# Altium project RF-lxSpark_1v0.PrjPcb
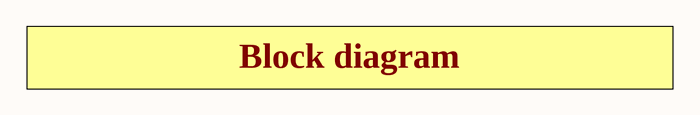
[diagram p0: 01_BlockDiagram.SchDoc]
7 sheets, 358 parts. Net scope: global (net labels, ports and power ports of the same name join across sheets).
Board file: SoDeRa-PCIe_1v0.PcbDoc
Sheets:
  01_BlockDiagram.SchDoc
  02_PowerDiagram.SchDoc
  03_ClockDiagram.SchDoc
  05_LMS7002M_RF.SchDoc
  06_LMS7002M_Power.SchDoc
  10_FPGA_power.SchDoc
  14_Clocks_2.SchDoc

## Sheet 01_BlockDiagram.SchDoc: Block diagram
size A4; Organization: Lime Microsystems; Address1: Surrey Tech Centre; Address2: Guildford GU2 7YG; Address3: Surrey; Address4: United Kingdom; Revision: SoDeRa-PCI v1.0; SheetNumber: 1; SheetTotal: 15

### Notes on the sheet
- Block diagram
- Title
- Size:
- Date:
- A4
- Revision:
- Time:
- Sheet
- of
- File:

## Sheet 02_PowerDiagram.SchDoc: Power diagram
size A4; Organization: Lime Microsystems; Address1: Surrey Tech Centre; Address2: Guildford GU2 7YG; Address3: Surrey; Address4: United Kingdom; Revision: SoDeRa-PCI v1.0; SheetNumber: 2; SheetTotal: 15
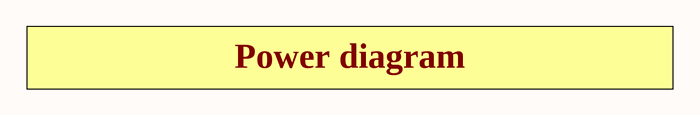
[diagram p1: 02_PowerDiagram.SchDoc]

### Notes on the sheet
- Power diagram
- Title
- Size:
- Date:
- A4
- Revision:
- Time:
- Sheet
- of
- File:

## Sheet 03_ClockDiagram.SchDoc: Clock diagram
size A4; Organization: Lime Microsystems; Address1: Surrey Tech Centre; Address2: Guildford GU2 7YG; Address3: Surrey; Address4: United Kingdom; Revision: SoDeRa-PCI v1.0; SheetNumber: 3; SheetTotal: 15
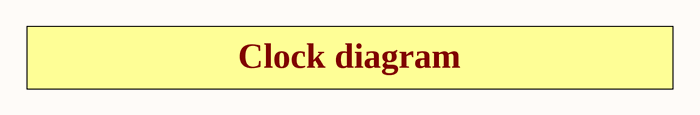
[diagram p2: 03_ClockDiagram.SchDoc]

### Notes on the sheet
- Clock diagram
- Title
- Size:
- Date:
- A4
- Revision:
- Time:
- Sheet
- of
- File:

## Sheet 05_LMS7002M_RF.SchDoc: LMS7002M 2 RF
size A3; Organization: Lime Microsystems; Address1: Surrey Tech Centre; Address2: Guildford GU2 7YG; Address3: Surrey; Address4: United Kingdom; Revision: SoDeRa-PCI v1.0; SheetNumber: 5; SheetTotal: 15
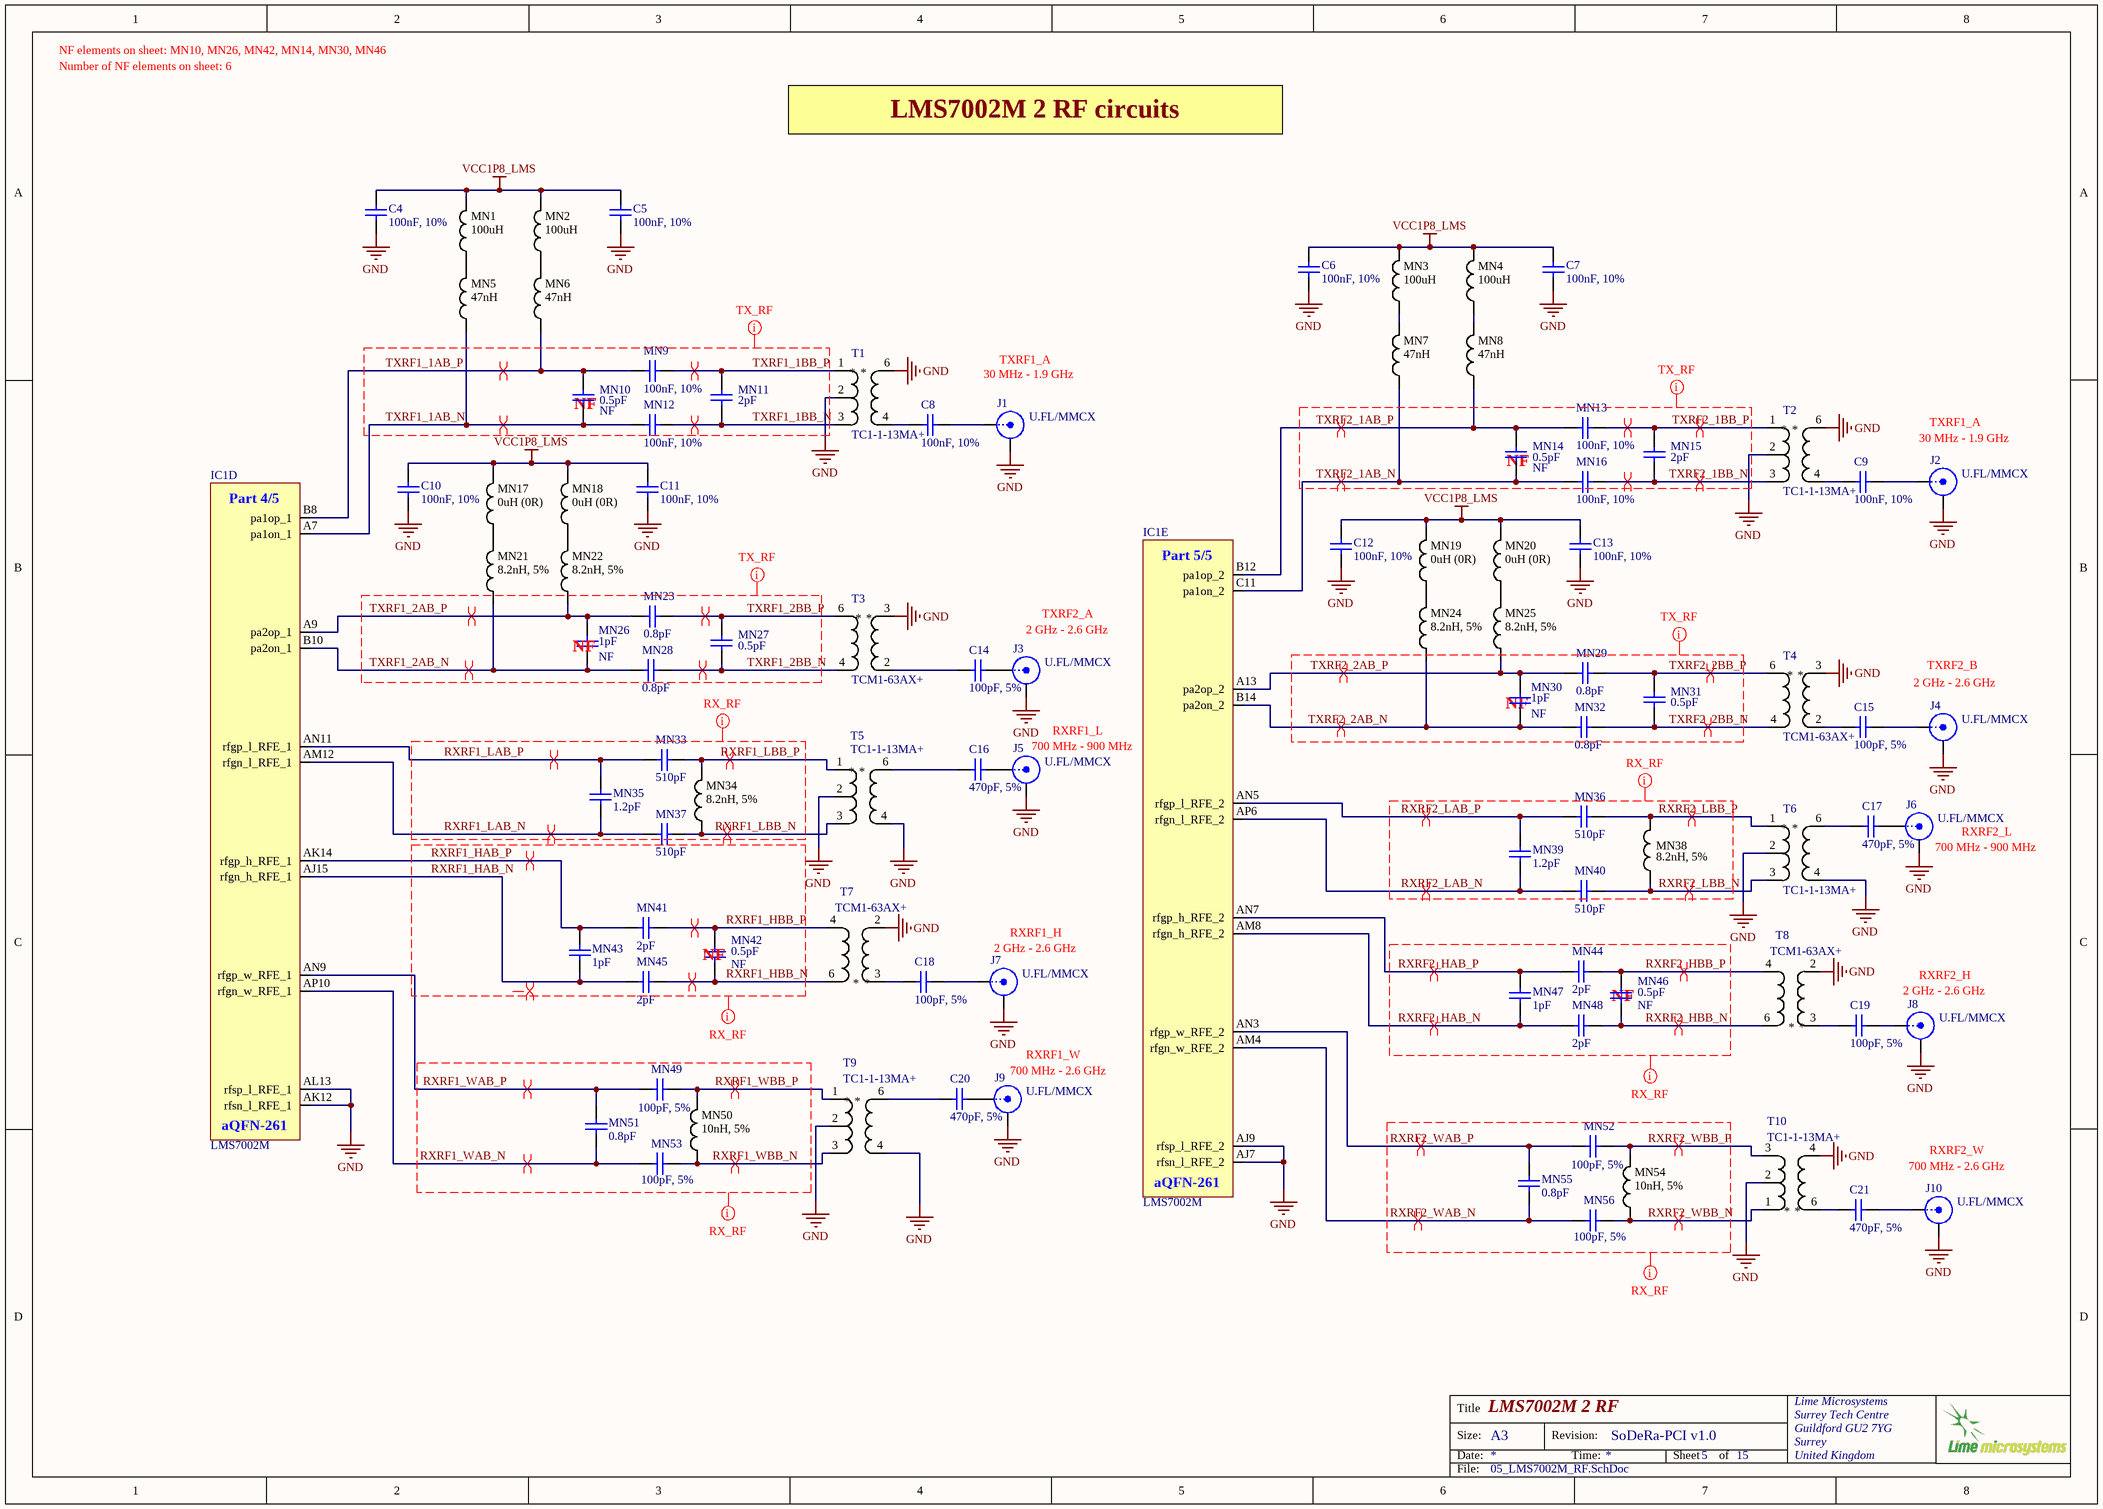
[diagram p3: 05_LMS7002M_RF.SchDoc]

### Parts
C4  100nF, 10%  [CAP0402]
C5  100nF, 10%  [CAP0402]
C6  100nF, 10%  [CAP0402]
C7  100nF, 10%  [CAP0402]
C8  100nF, 10%  [CAP0402]
C9  100nF, 10%  [CAP0402]
C10  100nF, 10%  [CAP0402]
C11  100nF, 10%  [CAP0402]
C12  100nF, 10%  [CAP0402]
C13  100nF, 10%  [CAP0402]
C14  100pF, 5%  [CAP0402]
C15  100pF, 5%  [CAP0402]
C16  470pF, 5%  [CAP0402]
C17  470pF, 5%  [CAP0402]
C18  100pF, 5%  [CAP0402]
C19  100pF, 5%  [CAP0402]
C20  470pF, 5%  [CAP0402]
C21  470pF, 5%  [CAP0402]
IC1  LMS7002M  [LMS7002M]  (parts D,E of 5)
J1  U.FL/MMCX  [MMCX_UFL_conn_u]
J2  U.FL/MMCX  [MMCX_UFL_conn_u]
J3  U.FL/MMCX  [MMCX_UFL_conn_u]
J4  U.FL/MMCX  [MMCX_UFL_conn_u]
J5  U.FL/MMCX  [MMCX_UFL_conn_u]
J6  U.FL/MMCX  [MMCX_UFL_conn_u]
J7  U.FL/MMCX  [MMCX_UFL_conn_u]
J8  U.FL/MMCX  [MMCX_UFL_conn_u]
J9  U.FL/MMCX  [MMCX_UFL_conn_u]
J10  U.FL/MMCX  [MMCX_UFL_conn_u]
MN1  100uH  [RES0805]
MN2  100uH  [RES0805]
MN3  100uH  [RES0805]
MN4  100uH  [RES0805]
MN5  47nH  [RES0402]
MN6  47nH  [RES0402]
MN7  47nH  [RES0402]
MN8  47nH  [RES0402]
MN9  100nF, 10%  [CAP0402]
MN10  0.5pF  Assembly Info: NF  [CAP0402]
MN11  2pF  [CAP0402]
MN12  100nF, 10%  [CAP0402]
MN13  100nF, 10%  [CAP0402]
MN14  0.5pF  Assembly Info: NF  [CAP0402]
MN15  2pF  [CAP0402]
MN16  100nF, 10%  [CAP0402]
MN17  0uH (0R)  [RES0805]
MN18  0uH (0R)  [RES0805]
MN19  0uH (0R)  [RES0805]
MN20  0uH (0R)  [RES0805]
MN21  8.2nH, 5%  [RES0402]
MN22  8.2nH, 5%  [RES0402]
MN23  0.8pF  [CAP0402]
MN24  8.2nH, 5%  [RES0402]
MN25  8.2nH, 5%  [RES0402]
MN26  1pF  Assembly Info: NF  [CAP0402]
MN27  0.5pF  [CAP0402]
MN28  0.8pF  [CAP0402]
MN29  0.8pF  [CAP0402]
MN30  1pF  Assembly Info: NF  [CAP0402]
MN31  0.5pF  [CAP0402]
MN32  0.8pF  [CAP0402]
MN33  510pF  [CAP0402]
MN34  8.2nH, 5%  [RES0402]
MN35  1.2pF  [CAP0402]
MN36  510pF  [CAP0402]
MN37  510pF  [CAP0402]
MN38  8.2nH, 5%  [RES0402]
MN39  1.2pF  [CAP0402]
MN40  510pF  [CAP0402]
MN41  2pF  [CAP0402]
MN42  0.5pF  Assembly Info: NF  [CAP0402]
MN43  1pF  [CAP0402]
MN44  2pF  [CAP0402]
MN45  2pF  [CAP0402]
MN46  0.5pF  Assembly Info: NF  [CAP0402]
MN47  1pF  [CAP0402]
MN48  2pF  [CAP0402]
MN49  100pF, 5%  [CAP0402]
MN50  10nH, 5%  [RES0402]
MN51  0.8pF  [CAP0402]
MN52  100pF, 5%  [CAP0402]
MN53  100pF, 5%  [CAP0402]
MN54  10nH, 5%  [RES0402]
MN55  0.8pF  [CAP0402]
MN56  100pF, 5%  [CAP0402]
T1  TC1-1-13MA+  [TC1-1-13MA+_v2]
T2  TC1-1-13MA+  [TC1-1-13MA+_v2]
T3  TCM1-63AX+  [TCM1-63AX+_v2]
T4  TCM1-63AX+  [TCM1-63AX+_v2]
T5  TC1-1-13MA+  [TC1-1-13MA+_v2]
T6  TC1-1-13MA+  [TC1-1-13MA+_v2]
T7  TCM1-63AX+  [TCM1-63AX+_v2]
T8  TCM1-63AX+  [TCM1-63AX+_v2]
T9  TC1-1-13MA+  [TC1-1-13MA+_v2]
T10  TC1-1-13MA+  [TC1-1-13MA+_v2]

### Nets
GND: C4.1 C5.1 C6.1 C7.1 C10.1 C11.1 C12.1 C13.1 IC1.AJ7(rfsn_l_RFE_2) IC1.AJ9(rfsp_l_RFE_2) IC1.AK12(rfsn_l_RFE_1) IC1.AL13(rfsp_l_RFE_1) J1.2(Y) J2.2(Y) J3.2(Y) J4.2(Y) J5.2(Y) J6.2(Y) J7.2(Y) J8.2(Y) J9.2(Y) J10.2(Y) T1.2 T1.6 T2.2 T2.6 T3.3 T4.3 T5.2 T5.4 T6.2 T6.4 T7.2 T8.2 T9.2 T9.4 T10.2 T10.4
VCC1P8_LMS: C4.2 C5.2 C6.2 C7.2 C10.2 C11.2 C12.2 C13.2 MN1.2 MN2.2 MN3.2 MN4.2 MN17.2 MN18.2 MN19.2 MN20.2
RXRF1_HAB_N: IC1.AJ15(rfgn_h_RFE_1) MN43.1 MN45.2
RXRF1_HAB_P: IC1.AK14(rfgp_h_RFE_1) MN41.2 MN43.2
RXRF1_HBB_N: MN42.1 MN45.1 T7.6
RXRF1_HBB_P: MN41.1 MN42.2 T7.4
RXRF1_LAB_N: IC1.AM12(rfgn_l_RFE_1) MN35.1 MN37.2
RXRF1_LAB_P: IC1.AN11(rfgp_l_RFE_1) MN33.2 MN35.2
RXRF1_LBB_N: MN34.1 MN37.1 T5.3
RXRF1_LBB_P: MN33.1 MN34.2 T5.1
RXRF1_WAB_N: IC1.AP10(rfgn_w_RFE_1) MN51.2 MN53.2
RXRF1_WAB_P: IC1.AN9(rfgp_w_RFE_1) MN49.2 MN51.1
RXRF1_WBB_N: MN50.1 MN53.1 T9.3
RXRF1_WBB_P: MN49.1 MN50.2 T9.1
RXRF2_HAB_N: IC1.AM8(rfgn_h_RFE_2) MN47.1 MN48.2
RXRF2_HAB_P: IC1.AN7(rfgp_h_RFE_2) MN44.2 MN47.2
RXRF2_HBB_N: MN46.1 MN48.1 T8.6
RXRF2_HBB_P: MN44.1 MN46.2 T8.4
RXRF2_LAB_N: IC1.AP6(rfgn_l_RFE_2) MN39.1 MN40.2
RXRF2_LAB_P: IC1.AN5(rfgp_l_RFE_2) MN36.2 MN39.2
RXRF2_LBB_N: MN38.1 MN40.1 T6.3
RXRF2_LBB_P: MN36.1 MN38.2 T6.1
RXRF2_WAB_N: IC1.AM4(rfgn_w_RFE_2) MN55.2 MN56.2
RXRF2_WAB_P: IC1.AN3(rfgp_w_RFE_2) MN52.2 MN55.1
RXRF2_WBB_N: MN54.1 MN56.1 T10.1
RXRF2_WBB_P: MN52.1 MN54.2 T10.3
TXRF1_1AB_N: IC1.A7(pa1on_1) MN5.1 MN10.1 MN12.1
TXRF1_1AB_P: IC1.B8(pa1op_1) MN6.1 MN9.2 MN10.2
TXRF1_1BB_N: MN11.1 MN12.2 T1.3
TXRF1_1BB_P: MN9.1 MN11.2 T1.1
TXRF1_2AB_N: IC1.B10(pa2on_1) MN21.1 MN26.2 MN28.2
TXRF1_2AB_P: IC1.A9(pa2op_1) MN22.1 MN23.2 MN26.1
TXRF1_2BB_N: MN27.1 MN28.1 T3.4
TXRF1_2BB_P: MN23.1 MN27.2 T3.6
TXRF2_1AB_N: IC1.C11(pa1on_2) MN7.1 MN14.1 MN16.1
TXRF2_1AB_P: IC1.B12(pa1op_2) MN8.1 MN13.2 MN14.2
TXRF2_1BB_N: MN15.1 MN16.2 T2.3
TXRF2_1BB_P: MN13.1 MN15.2 T2.1
TXRF2_2AB_N: IC1.B14(pa2on_2) MN24.1 MN30.2 MN32.2
TXRF2_2AB_P: IC1.A13(pa2op_2) MN25.1 MN29.2 MN30.1
TXRF2_2BB_N: MN31.1 MN32.1 T4.4
TXRF2_2BB_P: MN29.1 MN31.2 T4.6
NetC8_1: C8.1 J1.1(X)
NetC8_2: C8.2 T1.4
NetC9_1: C9.1 J2.1(X)
NetC9_2: C9.2 T2.4
NetC14_1: C14.1 J3.1(X)
NetC14_2: C14.2 T3.2
NetC15_1: C15.1 J4.1(X)
NetC15_2: C15.2 T4.2
NetC16_1: C16.1 J5.1(X)
NetC16_2: C16.2 T5.6
NetC17_1: C17.1 J6.1(X)
NetC17_2: C17.2 T6.6
NetC18_1: C18.1 J7.1(X)
NetC18_2: C18.2 T7.3
NetC19_1: C19.1 J8.1(X)
NetC19_2: C19.2 T8.3
NetC20_1: C20.1 J9.1(X)
NetC20_2: C20.2 T9.6
NetC21_1: C21.1 J10.1(X)
NetC21_2: C21.2 T10.6
NetMN1_1: MN1.1 MN5.2
NetMN2_1: MN2.1 MN6.2
NetMN3_1: MN3.1 MN7.2
NetMN4_1: MN4.1 MN8.2
NetMN17_1: MN17.1 MN21.2
NetMN18_1: MN18.1 MN22.2
NetMN19_1: MN19.1 MN24.2
NetMN20_1: MN20.1 MN25.2

### Layout directives
differential pair: RXRF1_HAB_N, RXRF1_HAB_P, RXRF1_HBB_N, RXRF1_HBB_P, RXRF1_LAB_N, RXRF1_LAB_P, RXRF1_LBB_N, RXRF1_LBB_P, RXRF1_WAB_N, RXRF1_WAB_P, RXRF1_WBB_N, RXRF1_WBB_P, RXRF2_HAB_N, RXRF2_HAB_P, RXRF2_HBB_N, RXRF2_HBB_P, RXRF2_LAB_N, RXRF2_LAB_P, RXRF2_LBB_N, RXRF2_LBB_P, RXRF2_WAB_N, RXRF2_WAB_P, RXRF2_WBB_N, RXRF2_WBB_P, TXRF1_1AB_N, TXRF1_1AB_P, TXRF1_1BB_N, TXRF1_1BB_P, TXRF1_2AB_N, TXRF1_2AB_P, TXRF1_2BB_N, TXRF1_2BB_P, TXRF2_1AB_N, TXRF2_1AB_P, TXRF2_1BB_N, TXRF2_1BB_P, TXRF2_2AB_N, TXRF2_2AB_P, TXRF2_2BB_N, TXRF2_2BB_P
net class TX_RF: TXRF1_1AB_N, TXRF1_1AB_P, TXRF1_1BB_N, TXRF1_1BB_P, TXRF1_2AB_N, TXRF1_2AB_P, TXRF1_2BB_N, TXRF1_2BB_P, TXRF2_1AB_N, TXRF2_1AB_P, TXRF2_1BB_N, TXRF2_1BB_P, TXRF2_2AB_N, TXRF2_2AB_P, TXRF2_2BB_N, TXRF2_2BB_P
net class RX_RF: RXRF1_HAB_N, RXRF1_HAB_P, RXRF1_HBB_N, RXRF1_HBB_P, RXRF1_LAB_N, RXRF1_LAB_P, RXRF1_LBB_N, RXRF1_LBB_P, RXRF1_WAB_N, RXRF1_WAB_P, RXRF1_WBB_N, RXRF1_WBB_P, RXRF2_HAB_N, RXRF2_HAB_P, RXRF2_HBB_N, RXRF2_HBB_P, RXRF2_LAB_N, RXRF2_LAB_P, RXRF2_LBB_N, RXRF2_LBB_P, RXRF2_WAB_N, RXRF2_WAB_P, RXRF2_WBB_N, RXRF2_WBB_P

### Notes on the sheet
- Number of NF elements on sheet: 6
- NF elements on sheet: MN10, MN26, MN42, MN14, MN30, MN46
- LMS7002M 2 RF circuits
- 30 MHz - 1.9 GHz
- TXRF1_A
- (near MN10) NF
- (near J2) 30 MHz - 1.9 GHz
- (near MN14) NF
- (near MN26) NF
- 2 GHz - 2.6 GHz
- TXRF2_A
- (near MN30) NF
- TXRF2_B
- (near J5) 700 MHz - 900 MHz
- RXRF1_L
- (near J6) 700 MHz - 900 MHz
- (near J6) RXRF2_L
- (near MN42) NF
- (near J7) 2 GHz - 2.6 GHz
- (near J7) RXRF1_H
- RXRF2_H
- RXRF1_W
- (near MN46) NF
- (near J8) 2 GHz - 2.6 GHz
- (near J9) 700 MHz - 2.6 GHz
- 700 MHz - 2.6 GHz
- (near J10) RXRF2_W
- Title
- Size:
- Date:
- A3
- Revision:
- Time:
- Sheet
- of
- File:
- (in symbol LMS7002M, part D) Part 4/5; aQFN-261
- (in symbol LMS7002M, part E) Part 5/5; aQFN-261

### Library data of the parts
C4-C13 = Cap_0402: Manufacturer: Murata Electronics; Manufacturer Part Number: GRM155R71C104KA88D; Voltage Rating DC: 16 V; Type: General Purpose MLCC; Capacitance: 0.1 uF; Case Length: 1 mm; Dielectric: X7R; Case Height: 0.5 mm; Temperature Coefficient / Code: +/- 15 %; Value: 100nF, 10%; Supplier 1: Mouser; Supplier Part Number 1: 81-GRM155R71C104KA88; Case Code - in: 0402; RoHS: RoHS Compliant; Operating Temperature Range: - 55 C to + 125 C; Series: GRM; Termination Style: SMD/SMT; Tolerance: 10 %; Package / Case: 0402 (1005 metric); Maximum Operating Temperature: + 125 C; Case Code - mm: 1005; Minimum Operating Temperature: - 55 C; Product Category: Low & Medium Capacitance SMD Ceramic Chip Capacitors; Packaging: Reel; Product: General Type MLCCs; Category: Multilayer Ceramic Capacitors MLCC - SMD/SMT; Brand: Murata Electronics; Case Width: 0.5 mm; RoHS - Mouser: Y; Standard Pack Qty: 10000; Minimum Order Quantity: 1; Reeling: True; Manufacturer Part Number 1: GRM155R71C104KA88D
C14 C15 C18 C19 MN49 MN52 MN53 MN56 = Cap_0402: Manufacturer Part Number 1: CC0402JRNPO9BN101; Manufacturer: Yageo; Temperature Coefficient: C0G, NP0; Voltage - Rated: 50V; Value: 100pF, 5%; Capacitance: 100pF; Thickness (Max): 0.022" (0.55mm); Size / Dimension: 0.039" L x 0.020" W (1.00mm x 0.50mm); Tolerance: ±5%; RoHS: RoHS Compliant; Ratings: -; Package / Case: 0402 (1005 Metric); Mounting Type: Surface Mount, MLCC; Height - Seated (Max): -; Features: -; Lead Spacing: -; Operating Temperature: -55°C ~ 125°C; Packaging: Cut Tape (CT); Applications: General Purpose; Lead Style: -; Supplier 1: Digi-Key; Category: Capacitors; Supplier Part Number 1: 311-1024-1-ND
C16 C17 C20 C21 = Cap_0402: Manufacturer Part Number: C1005C0G1H471J050BA; Manufacturer: TDK Corporation; Temperature Coefficient: C0G, NP0; Voltage - Rated: 50V; Value: 470pF, 5%; Supplier 1: Digi-Key; Supplier Part Number 1: 445-2656-6-ND; Ratings: -; Package / Case: 0402 (1005 Metric); Capacitance: 470pF; Packaging: Digi-Reel®; RoHS: RoHS Compliant; Tolerance: ±5%; Lead Style: -; Thickness (Max): 0.022" (0.55mm); Size / Dimension: 0.039" L x 0.020" W (1.00mm x 0.50mm); Lead Spacing: -; Operating Temperature: -55°C ~ 125°C; Height - Seated (Max): -; Applications: General Purpose; Mounting Type: Surface Mount, MLCC; Category: Capacitors; Features: -
J1-J10 = RF_IF_connector: CONN UMC RCPT STR 50 OHM SMD; Manufacturer: Molex, LLC; Manufacturer Part Number 1: 0734120110; Body Finish: Nickel; Body Material: Phosphor Bronze; Center Contact Material: Brass; Center Contact Plating: Gold; Connector Style: Ultra Miniature Coaxial; Connector Type: Jack, Male Pin; Contact Termination: Solder; Dielectric Material: Liquid Crystal Polymer (LCP); Frequency - Max: 6GHz; Impedance: 50 Ohm; Voltage Rating: 60V; Cable Group: -; Category: Connectors, Interconnects; Fastening Type: Snap-On; Features: -; Housing Color: Silver; Ingress Protection: -; Mounting Type: Surface Mount; Operating Temperature: -40°C ~ 90°C; Packaging: Cut Tape (CT); RoHS: RoHS Compliant; Shield Termination: Solder; Supplier 1: Digi-Key; Supplier Part Number 1: WM5587CT-ND
MN1-MN4 = Inductor_0603: Manufacturer: TDK Corporation; Manufacturer Part Number: MLF2012C101KT000; Q @ Freq: 25 @ 1MHz; Shielding: Shielded; Current Rating: 2mA; Frequency - Self Resonant: 7MHz; Frequency - Test: 1MHz; Material - Core: Ferrite; Tolerance: ±10%; Inductance: 100µH; DC Resistance (DCR): 3.1 Ohm Max; Value: 100uH; Supplier 1: Digi-Key; Supplier Part Number 1: 445-1071-1-ND; Supplier Device Package: 0805 (2012 Metric); Size / Dimension: 0.079" L x 0.049" W (2.00mm x 1.25mm); Operating Temperature: -40°C ~ 85°C; Packaging: Cut Tape (CT); RoHS: RoHS Compliant; Current - Saturation: -; Height - Seated (Max): 0.057" (1.45mm); Package / Case: 0805 (2012 Metric); Mounting Type: Surface Mount; Type: Multilayer; Category: Inductors, Coils, Chokes
MN5-MN8 = Inductor_0603: Manufacturer: COILCRAFT; Manufacturer Part Number: 0402HP-47NXJLU; SVHC: No SVHC (15-Jun-2015); Inductance Tolerance: ± 5%; High Frequency Inductor Case: 0402 [1005 Metric]; Inductor Case Style: 0402 [1005 Metric]<!--FANDB--><div class="features-and-benefits-container"></div>; Inductance: 47; DC Resistance Max: 0.58; Self Resonant Frequency Min: 2.4; Product Range: 0402; DC Current Rating: 420; Inductor Construction: Wirewound; Supplier 1: Farnell; Supplier Part Number 1: 2285856; Packaging: Cut Tape; RoHS: Y-EX; value: 47nH
MN9 MN12 MN13 MN16 = Cap_0402: Manufacturer: Murata Electronics; Manufacturer Part Number: GRM155R71C104KA88D; Voltage Rating DC: 16 V; Capacitance: 0.1 uF; Case Length: 1 mm; Dielectric: X7R; Case Height: 0.5 mm; Temperature Coefficient / Code: +/- 15 %; Value: 100nF, 10%; Supplier 1: Mouser; Supplier Part Number 1: 81-GRM155R71C104KA88; Case Code - in: 0402; RoHS: RoHS Compliant; Operating Temperature Range: - 55 C to + 125 C; Series: GRM; Termination Style: SMD/SMT; Tolerance: 10 %; Package / Case: 0402 (1005 metric); Type: General Purpose MLCC; Maximum Operating Temperature: + 125 C; Case Code - mm: 1005; Minimum Operating Temperature: - 55 C; Product Category: Low & Medium Capacitance SMD Ceramic Chip Capacitors; Packaging: Reel; Product: General Type MLCCs; Category: Multilayer Ceramic Capacitors MLCC - SMD/SMT; Brand: Murata Electronics; Case Width: 0.5 mm; RoHS - Mouser: Y; Standard Pack Qty: 10000; Minimum Order Quantity: 1; Reeling: True; Manufacturer Part Number 1: GRM155R71C104KA88D
MN10 MN14 MN27 MN31 MN42 MN46 = Cap_0402: Manufacturer: Yageo; Manufacturer Part Number 1: CC0402CRNPO9BNR50; Capacitance: 0.50pF; Voltage - Rated: 50V; Temperature Coefficient: C0G, NP0; Tolerance: ±0.25pF; Value: 0.5pF; Supplier 1: Digi-Key; Supplier Part Number 1: 311-1001-1-ND; RoHS: RoHS Compliant; Thickness (Max): 0.022" (0.55mm); Features: -; Height - Seated (Max): -; Lead Spacing: -; Applications: General Purpose; Packaging: Cut Tape (CT); Ratings: -; Size / Dimension: 0.039" L x 0.020" W (1.00mm x 0.50mm); Lead Style: -; Mounting Type: Surface Mount, MLCC; Operating Temperature: -55°C ~ 125°C; Package / Case: 0402 (1005 Metric); Category: Capacitors
MN11 MN15 MN41 MN44 MN45 MN48 = Cap_0402: Manufacturer Part Number: 04025U2R0BAT2A; Manufacturer: AVX; Product Range: U Series; Voltage Rating: 50; SVHC: No SVHC (17-Dec-2014); Capacitance Tolerance: ± 0.1; Ceramic Capacitor Case: 0402 [1005 Metric]; Capacitance: 2; Dielectric Characteristic: C0G / NP0; Value: 2pF; Supplier 1: Farnell; Supplier Part Number 1: 2332536; Operating Temperature Max: 125; RoHS: YES; Operating Temperature Min: -55; Capacitance Tolerance ±: ± 0.1; Packaging: Cut Tape; MSL: MSL 1 - Unlimited
MN17-MN20 = Inductor_0603: Manufacturer: BOURNS; Manufacturer Part Number: CR0805-J/-000ELF; Value: 0uH (0R); Supplier 1: Farnell; Supplier Part Number 1: 2008388; RoHS: YES
MN21 MN22 MN24 MN25 MN34 MN38 = Inductor_0603: Manufacturer: COILCRAFT; Manufacturer Part Number 1: 0402HP-8N2XJLU; Inductor Construction: Wirewound; DC Current Rating: 1.5; Inductor Case Style: 0402 [1005 Metric]<!--FANDB--><div class="features-and-benefits-container"></div>; Self Resonant Frequency Min: 5.4; DC Resistance Max: 0.065; High Frequency Inductor Case: 0402 [1005 Metric]; SVHC: No SVHC (16-Jun-2014); Inductance: 8.2; Supplier 1: Farnell; Supplier Part Number 1: 2285826; Packaging: Cut Tape; Product Range: COILCRAFT - 0402; Inductance Tolerance: ± 5%; RoHS: Y-EX; Value: 8.2nH, 5%
MN23 MN28 MN29 MN32 MN51 MN55 = Cap_0402: Manufacturer: Murata Electronics North America; Manufacturer Part Number: GRM1555C1HR80BA01D; Temperature Coefficient: C0G, NP0; Capacitance: 0.80pF; Voltage - Rated: 50V; Tolerance: ±0.1pF; Value: 0.8pF; Applications: General Purpose; Operating Temperature: -55°C ~ 125°C; Size / Dimension: 0.039" L x 0.020" W (1.00mm x 0.50mm); Features: -; Supplier 1: Digi-Key; Height - Seated (Max): -; Category: Capacitors; Package / Case: 0402 (1005 Metric); Mounting Type: Surface Mount, MLCC; Lead Spacing: -; Thickness (Max): 0.022" (0.55mm); RoHS: RoHS Compliant; Supplier Part Number 1: 490-6269-1-ND; Packaging: Cut Tape (CT); Ratings: -; Lead Style: -
MN26 MN30 MN43 MN47 = Cap_0402: Manufacturer: TDK Corporation; Manufacturer Part Number 1: C1005C0G1H010B050BA; Voltage - Rated: 50V; Temperature Coefficient: C0G, NP0; Tolerance: ±0.1pF; Value: 1pF; Supplier 1: Digi-Key; Supplier Part Number 1: 445-4854-6-ND; Size / Dimension: 0.039" L x 0.020" W (1.00mm x 0.50mm); Lead Spacing: -; Operating Temperature: -55°C ~ 125°C; Thickness (Max): 0.022" (0.55mm); Package / Case: 0402 (1005 Metric); Features: -; Lead Style: -; Applications: General Purpose; Height - Seated (Max): -; Capacitance: 1pF; RoHS: RoHS Compliant; Mounting Type: Surface Mount, MLCC; Packaging: Digi-Reel®; Ratings: -; Category: Capacitors
MN33 MN36 MN37 MN40 = Cap_0402: Manufacturer: Murata Electronics North America; Manufacturer Part Number: GRM1555C1H511JA01D; Voltage - Rated: 50V; Temperature Coefficient: C0G, NP0; Tolerance: ±5%; Value: 510pF; Supplier 1: Digi-Key; Supplier Part Number 1: 490-3237-1-ND; Height - Seated (Max): -; Features: -; Size / Dimension: 0.039" L x 0.020" W (1.00mm x 0.50mm); Applications: General Purpose; Lead Spacing: -; Package / Case: 0402 (1005 Metric); Ratings: -; Thickness (Max): 0.022" (0.55mm); Lead Style: -; Operating Temperature: -55°C ~ 125°C; Mounting Type: Surface Mount, MLCC; Capacitance: 510pF; Category: Capacitors; RoHS: RoHS Compliant; Packaging: Cut Tape (CT)
MN35 MN39 = Cap_0402: Manufacturer: Murata Electronics North America; Manufacturer Part Number: GRM1555C1H1R2CA01D; Temperature Coefficient: C0G, NP0; Voltage - Rated: 50V; Tolerance: ±0.25pF; Value: 1.2pF; Supplier 1: Digi-Key; Supplier Part Number 1: 490-5927-1-ND; Lead Style: -; Category: Capacitors; Features: -; Packaging: Cut Tape (CT); Operating Temperature: -55°C ~ 125°C; Package / Case: 0402 (1005 Metric); Applications: General Purpose; Size / Dimension: 0.039" L x 0.020" W (1.00mm x 0.50mm); Lead Spacing: -; Ratings: -; Mounting Type: Surface Mount, MLCC; RoHS: RoHS Compliant; Height - Seated (Max): -; Thickness (Max): 0.022" (0.55mm); Capacitance: 1.2pF
MN50 MN54 = Inductor_0603: Manufacturer Part Number: 0402HP-10NXJLU; Manufacturer: COILCRAFT; Value: 10nH, 5%; Supplier 1: Farnell; Supplier Part Number 1: 2285830; RoHS: Y-EX
T1 T2 T5 T6 T9 T10 = Balun: Manufacturer: Mini-Circuits; Manufacturer Part Number 1: TC1-1-13MA+; Supplier Part Number 1: TC1-1-13MA+
T3 T4 T7 T8 = Balun_v2: Manufacturer: Mini-circuits; Supplier Part Number 1: TCM1-63AX+; Manufacturer Part Number 1: TCM1-63AX+
IC1 = LMS7002M: Manufacturer Part Number 1: LMS7002M; Supplier 1: Lime Microsystems

## Sheet 06_LMS7002M_Power.SchDoc: LMS7002M 1 power supply
size A3 portrait; Organization: Lime Microsystems; Address1: Surrey Tech Centre; Address2: Guildford GU2 7YG; Address3: Surrey; Address4: United Kingdom; Revision: SoDeRa-PCI v1.0; SheetNumber: 6; SheetTotal: 15; PageSetup: Record=PageOptions|CenterHorizontal=True|CenterVertical=True|PrintScale=0.70|XCorrection=1.00|YCorrection=1.00|PrintKind=1|BorderSize=5000000|LeftOffset=0|BottomOffset=0|Orientation=1|PaperLength=2970|PaperWidth=2100|Scale=100|PaperSource=7|PrintQuality=600|MediaType=1|DitherType=10|PrintScaleMode=1|PaperKind=A4|PaperIndex=9
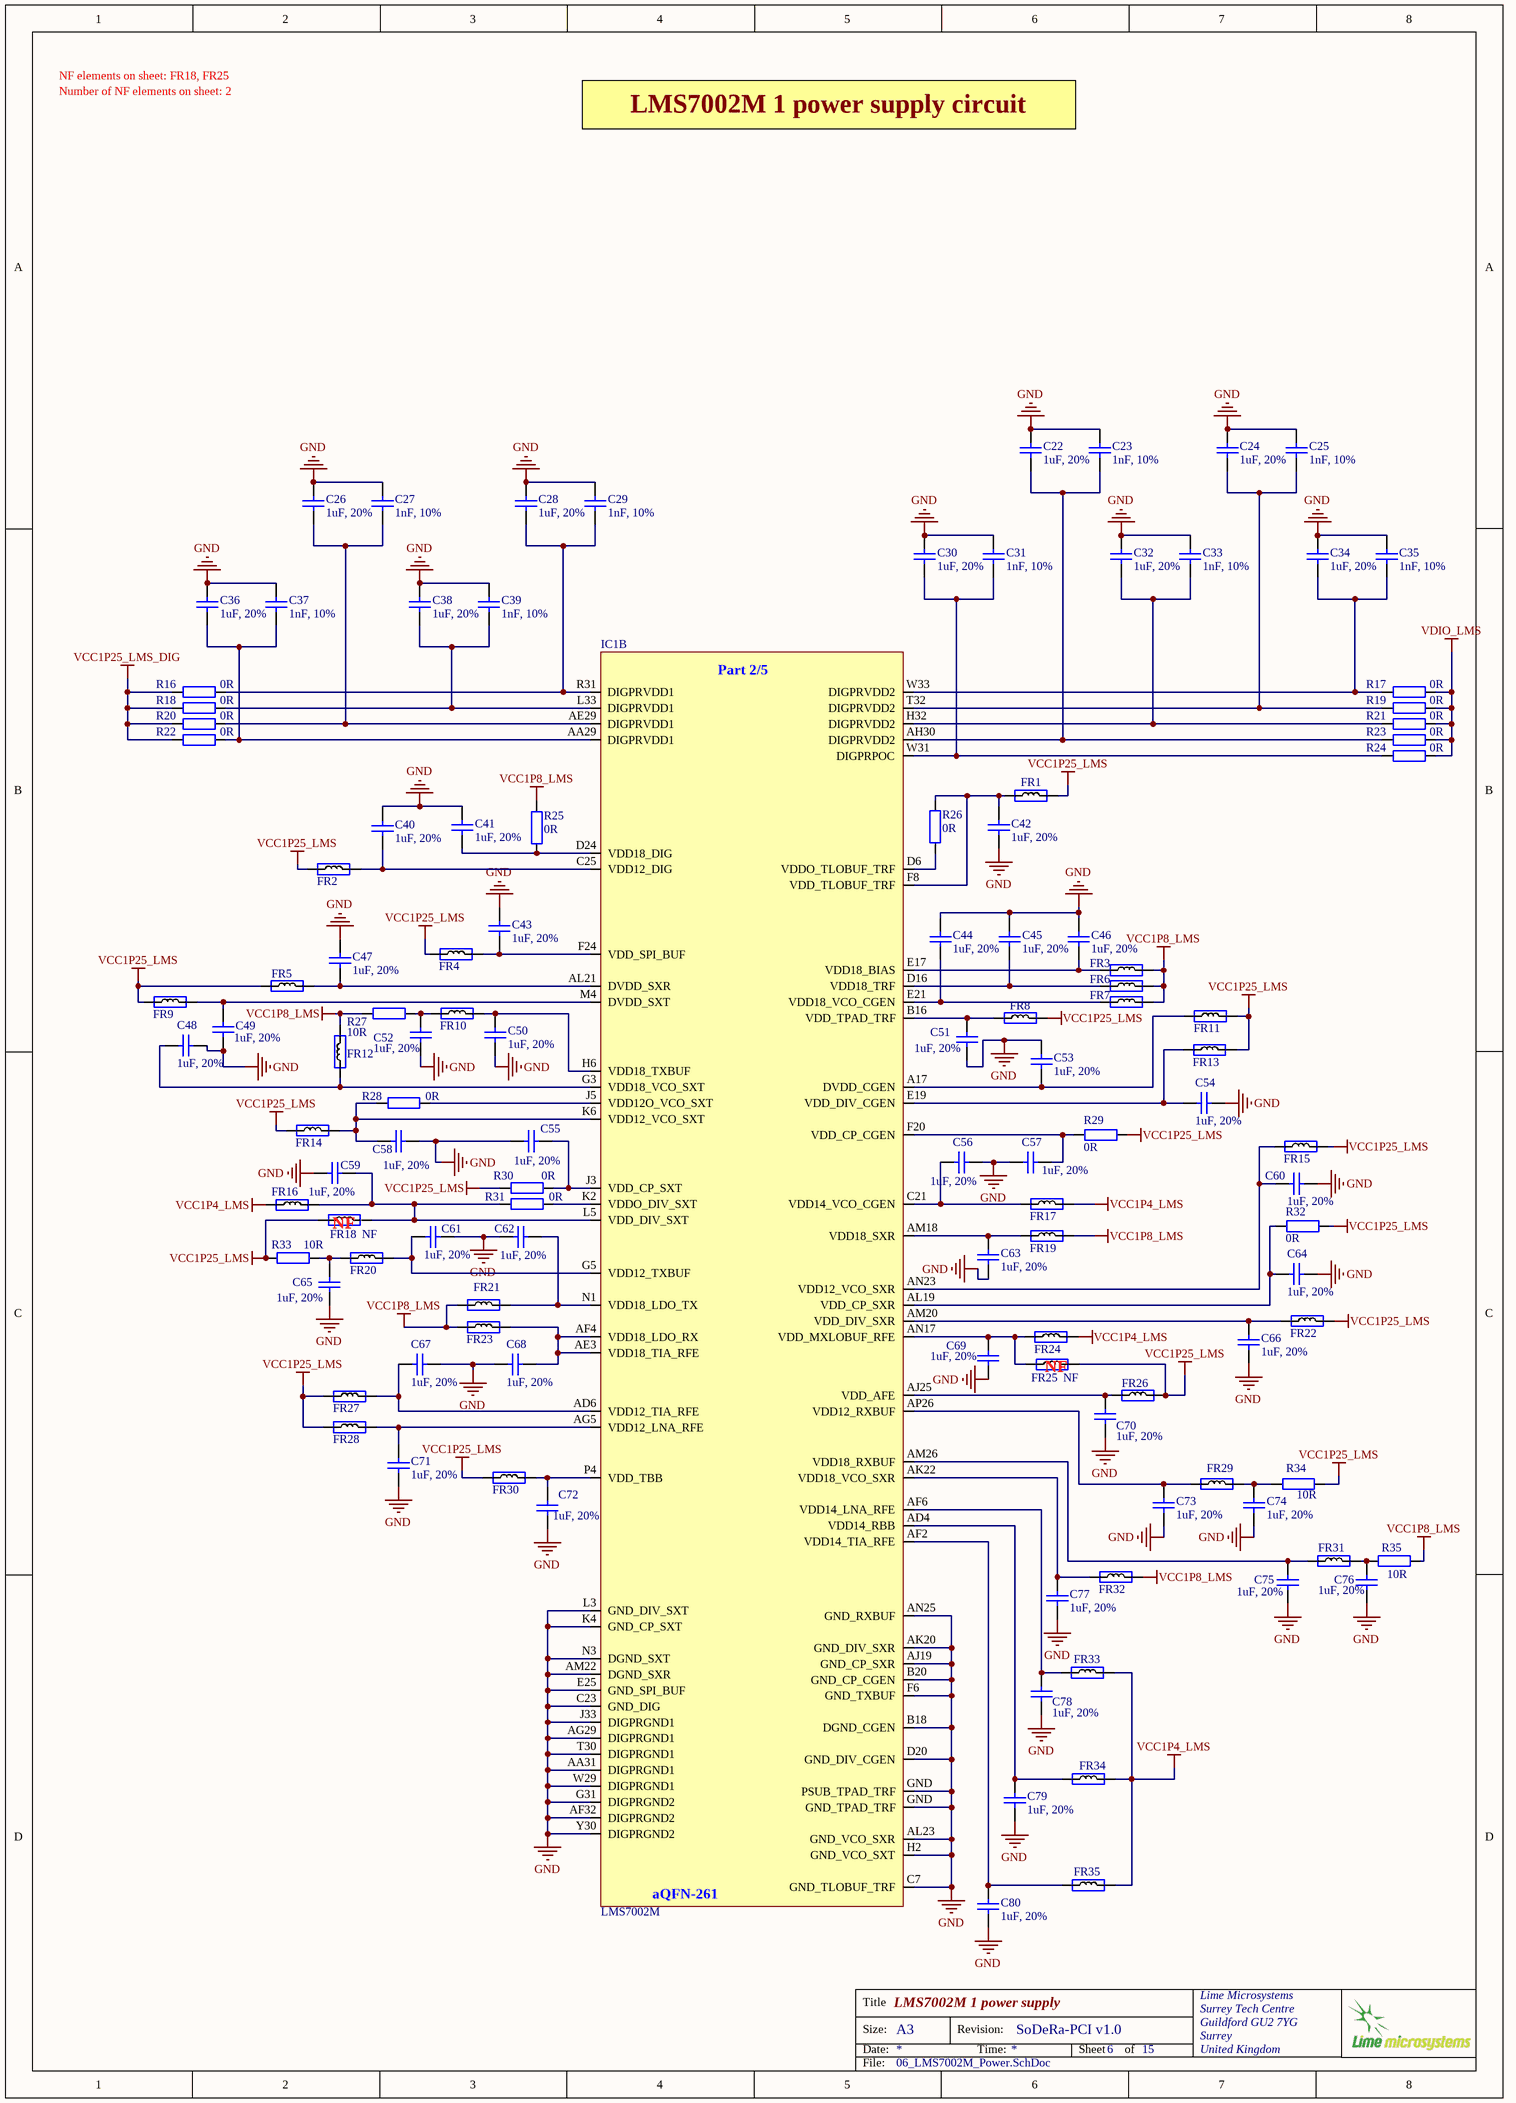
[diagram p4: 06_LMS7002M_Power.SchDoc]

### Parts
C22  1uF, 20%  [CAP0201]
C23  1nF, 10%  [CAP0201]
C24  1uF, 20%  [CAP0201]
C25  1nF, 10%  [CAP0201]
C26  1uF, 20%  [CAP0201]
C27  1nF, 10%  [CAP0201]
C28  1uF, 20%  [CAP0201]
C29  1nF, 10%  [CAP0201]
C30  1uF, 20%  [CAP0201]
C31  1nF, 10%  [CAP0201]
C32  1uF, 20%  [CAP0201]
C33  1nF, 10%  [CAP0201]
C34  1uF, 20%  [CAP0201]
C35  1nF, 10%  [CAP0201]
C36  1uF, 20%  [CAP0201]
C37  1nF, 10%  [CAP0201]
C38  1uF, 20%  [CAP0201]
C39  1nF, 10%  [CAP0201]
C40  1uF, 20%  [CAP0201]
C41  1uF, 20%  [CAP0201]
C42  1uF, 20%  [CAP0201]
C43  1uF, 20%  [CAP0201]
C44  1uF, 20%  [CAP0201]
C45  1uF, 20%  [CAP0201]
C46  1uF, 20%  [CAP0201]
C47  1uF, 20%  [CAP0201]
C48  1uF, 20%  [CAP0201]
C49  1uF, 20%  [CAP0201]
C50  1uF, 20%  [CAP0201]
C51  1uF, 20%  [CAP0201]
C52  1uF, 20%  [CAP0201]
C53  1uF, 20%  [CAP0201]
C54  1uF, 20%  [CAP0201]
C55  1uF, 20%  [CAP0201]
C56  1uF, 20%  [CAP0201]
C57  1uF, 20%  [CAP0201]
C58  1uF, 20%  [CAP0201]
C59  1uF, 20%  [CAP0201]
C60  1uF, 20%  [CAP0201]
C61  1uF, 20%  [CAP0201]
C62  1uF, 20%  [CAP0201]
C63  1uF, 20%  [CAP0201]
C64  1uF, 20%  [CAP0201]
C65  1uF, 20%  [CAP0201]
C66  1uF, 20%  [CAP0201]
C67  1uF, 20%  [CAP0201]
C68  1uF, 20%  [CAP0201]
C69  1uF, 20%  [CAP0201]
C70  1uF, 20%  [CAP0201]
C71  1uF, 20%  [CAP0201]
C72  1uF, 20%  [CAP0201]
C73  1uF, 20%  [CAP0201]
C74  1uF, 20%  [CAP0201]
C75  1uF, 20%  [CAP0201]
C76  1uF, 20%  [CAP0201]
C77  1uF, 20%  [CAP0201]
C78  1uF, 20%  [CAP0201]
C79  1uF, 20%  [CAP0201]
C80  1uF, 20%  [CAP0201]
FR1  Ferrite  [RES0201]  (value not drawn)
FR2  Ferrite  [RES0201]  (value not drawn)
FR3  Ferrite  [RES0201]  (value not drawn)
FR4  Ferrite  [RES0201]  (value not drawn)
FR5  Ferrite  [RES0201]  (value not drawn)
FR6  Ferrite  [RES0201]  (value not drawn)
FR7  Ferrite  [RES0201]  (value not drawn)
FR8  Ferrite  [RES0201]  (value not drawn)
FR9  Ferrite  [RES0201]  (value not drawn)
FR10  Ferrite  [RES0201]  (value not drawn)
FR11  Ferrite  [RES0201]  (value not drawn)
FR12  Ferrite  [RES0201]  (value not drawn)
FR13  Ferrite  [RES0201]  (value not drawn)
FR14  Ferrite  [RES0201]  (value not drawn)
FR15  Ferrite  [RES0201]  (value not drawn)
FR16  Ferrite  [RES0201]  (value not drawn)
FR17  Ferrite  [RES0201]  (value not drawn)
FR18  Assembly Info: NF  [RES0201]  (hidden comment: Ferrite)
FR19  Ferrite  [RES0201]  (value not drawn)
FR20  Ferrite  [RES0201]  (value not drawn)
FR21  Ferrite  [RES0201]  (value not drawn)
FR22  Ferrite  [RES0201]  (value not drawn)
FR23  Ferrite  [RES0201]  (value not drawn)
FR24  Ferrite  [RES0201]  (value not drawn)
FR25  Assembly Info: NF  [RES0201]  (hidden comment: Ferrite)
FR26  Ferrite  [RES0201]  (value not drawn)
FR27  Ferrite  [RES0201]  (value not drawn)
FR28  Ferrite  [RES0201]  (value not drawn)
FR29  Ferrite  [RES0201]  (value not drawn)
FR30  Ferrite  [RES0201]  (value not drawn)
FR31  Ferrite  [RES0201]  (value not drawn)
FR32  Ferrite  [RES0201]  (value not drawn)
FR33  Ferrite  [RES0201]  (value not drawn)
FR34  Ferrite  [RES0201]  (value not drawn)
FR35  Ferrite  [RES0201]  (value not drawn)
IC1  LMS7002M  [LMS7002M]  (part B of 5)
R16  0R  [RES0402]
R17  0R  [RES0402]
R18  0R  [RES0402]
R19  0R  [RES0402]
R20  0R  [RES0402]
R21  0R  [RES0402]
R22  0R  [RES0402]
R23  0R  [RES0402]
R24  0R  [RES0402]
R25  0R  [RES0201]
R26  0R  [RES0201]
R27  10R  [RES0201]
R28  0R  [RES0201]
R29  0R  [RES0201]
R30  0R  [RES0201]
R31  0R  [RES0201]
R32  0R  [RES0201]
R33  10R  [RES0201]
R34  10R  [RES0201]
R35  10R  [RES0201]

### Nets
GND: C22.2 C23.2 C24.2 C25.2 C26.2 C27.2 C28.2 C29.2 C30.2 C31.2 C32.2 C33.2 C34.2 C35.2 C36.2 C37.2 C38.2 C39.2 C40.2 C41.2 C42.2 C43.2 C44.2 C45.2 C46.2 C47.2 C48.2 C49.2 C50.2 C51.2 C52.2 C53.2 C54.2 C55.2 C56.2 C57.2 C58.1 C59.2 C60.2 C61.2 C62.2 C63.2 C64.2 C65.2 C66.2 C67.2 C68.2 C69.2 C70.2 C71.2 C72.2 C73.2 C74.2 C75.2 C76.2 C77.2 C78.2 C79.2 C80.2 IC1.AA31(DIGPRGND1) IC1.AF32(DIGPRGND2) IC1.AG29(DIGPRGND1) IC1.AJ19(GND_CP_SXR) IC1.AK20(GND_DIV_SXR) IC1.AL23(GND_VCO_SXR) IC1.AM22(DGND_SXR) IC1.AN25(GND_RXBUF) IC1.B18(DGND_CGEN) IC1.B20(GND_CP_CGEN) IC1.C7(GND_TLOBUF_TRF) IC1.C23(GND_DIG) IC1.D20(GND_DIV_CGEN) IC1.E25(GND_SPI_BUF) IC1.F6(GND_TXBUF) IC1.G31(DIGPRGND2) IC1.GND(PSUB_TPAD_TRF) IC1.H2(GND_VCO_SXT) IC1.J33(DIGPRGND1) IC1.K4(GND_CP_SXT) IC1.L3(GND_DIV_SXT) IC1.N3(DGND_SXT) IC1.T30(DIGPRGND1) IC1.W29(DIGPRGND1) IC1.Y30(DIGPRGND2)
VCC1P4_LMS: FR16.1 FR17.2 FR24.2 FR33.2 FR34.2 FR35.2
VCC1P8_LMS: FR3.2 FR6.2 FR7.2 FR12.2 FR19.2 FR21.1 FR23.1 FR32.2 R25.2 R27.2 R35.1
VCC1P25_LMS: FR1.2 FR2.1 FR4.1 FR5.1 FR8.2 FR9.1 FR11.2 FR13.2 FR14.1 FR15.2 FR18.1 FR22.2 FR25.2 FR26.2 FR27.1 FR28.1 FR30.1 R29.1 R30.2 R32.1 R33.2 R34.1
VCC1P25_LMS_DIG: R16.2 R18.2 R20.2 R22.2
VDIO_LMS: R17.1 R19.1 R21.1 R23.1 R24.1
NetC22_1: C22.1 C23.1 IC1.AH30(DIGPRVDD2) R23.2
NetC24_1: C24.1 C25.1 IC1.T32(DIGPRVDD2) R19.2
NetC26_1: C26.1 C27.1 IC1.AE29(DIGPRVDD1) R20.1
NetC28_1: C28.1 C29.1 IC1.R31(DIGPRVDD1) R16.1
NetC30_1: C30.1 C31.1 IC1.W31(DIGPRPOC) R24.2
NetC32_1: C32.1 C33.1 IC1.H32(DIGPRVDD2) R21.2
NetC34_1: C34.1 C35.1 IC1.W33(DIGPRVDD2) R17.2
NetC36_1: C36.1 C37.1 IC1.AA29(DIGPRVDD1) R22.1
NetC38_1: C38.1 C39.1 IC1.L33(DIGPRVDD1) R18.1
NetC40_1: C40.1 FR2.2 IC1.C25(VDD12_DIG)
NetC41_1: C41.1 IC1.D24(VDD18_DIG) R25.1
NetC42_1: C42.1 FR1.1 IC1.F8(VDD_TLOBUF_TRF) R26.1
NetC43_1: C43.1 FR4.2 IC1.F24(VDD_SPI_BUF)
NetC44_1: C44.1 FR7.1 IC1.E21(VDD18_VCO_CGEN)
NetC45_1: C45.1 FR6.1 IC1.D16(VDD18_TRF)
NetC46_1: C46.1 FR3.1 IC1.E17(VDD18_BIAS)
NetC47_1: C47.1 FR5.2 IC1.AL21(DVDD_SXR)
NetC48_1: C48.1 FR12.1 IC1.G3(VDD18_VCO_SXT)
NetC49_1: C49.1 FR9.2 IC1.M4(DVDD_SXT)
NetC50_1: C50.1 FR10.2 IC1.H6(VDD18_TXBUF)
NetC51_1: C51.1 FR8.1 IC1.B16(VDD_TPAD_TRF)
NetC52_1: C52.1 FR10.1 R27.1
NetC53_1: C53.1 FR11.1 IC1.A17(DVDD_CGEN)
NetC54_1: C54.1 FR13.1 IC1.E19(VDD_DIV_CGEN)
NetC55_1: C55.1 IC1.J3(VDD_CP_SXT) R30.1
NetC56_1: C56.1 FR17.1 IC1.C21(VDD14_VCO_CGEN)
NetC57_1: C57.1 IC1.F20(VDD_CP_CGEN) R29.2
NetC58_2: C58.2 FR14.2 IC1.K6(VDD12_VCO_SXT) R28.2
NetC59_1: C59.1 FR16.2 FR18.2 IC1.L5(VDD_DIV_SXT) R31.2
NetC60_1: C60.1 FR15.1 IC1.AN23(VDD12_VCO_SXR)
NetC61_1: C61.1 FR20.2 IC1.G5(VDD12_TXBUF)
NetC62_1: C62.1 FR21.2 IC1.N1(VDD18_LDO_TX)
NetC63_1: C63.1 FR19.1 IC1.AM18(VDD18_SXR)
NetC64_1: C64.1 IC1.AL19(VDD_CP_SXR) R32.2
NetC65_1: C65.1 FR20.1 R33.1
NetC66_1: C66.1 FR22.1 IC1.AM20(VDD_DIV_SXR)
NetC67_1: C67.1 FR27.2 IC1.AD6(VDD12_TIA_RFE)
NetC68_1: C68.1 FR23.2 IC1.AE3(VDD18_TIA_RFE) IC1.AF4(VDD18_LDO_RX)
NetC69_1: C69.1 FR24.1 FR25.1 IC1.AN17(VDD_MXLOBUF_RFE)
NetC70_1: C70.1 FR26.1 IC1.AJ25(VDD_AFE)
NetC71_1: C71.1 FR28.2 IC1.AG5(VDD12_LNA_RFE)
NetC72_1: C72.1 FR30.2 IC1.P4(VDD_TBB)
NetC73_1: C73.1 FR29.1 IC1.AP26(VDD12_RXBUF)
NetC74_1: C74.1 FR29.2 R34.2
NetC75_1: C75.1 FR31.1 IC1.AM26(VDD18_RXBUF)
NetC76_1: C76.1 FR31.2 R35.2
NetC77_1: C77.1 FR32.1 IC1.AK22(VDD18_VCO_SXR)
NetC78_1: C78.1 FR33.1 IC1.AF6(VDD14_LNA_RFE)
NetC79_1: C79.1 FR34.1 IC1.AD4(VDD14_RBB)
NetC80_1: C80.1 FR35.1 IC1.AF2(VDD14_TIA_RFE)
NetIC1_D6: IC1.D6(VDDO_TLOBUF_TRF) R26.2
NetIC1_J5: IC1.J5(VDD12O_VCO_SXT) R28.1
NetIC1_K2: IC1.K2(VDDO_DIV_SXT) R31.1

### Notes on the sheet
- Number of NF elements on sheet: 2
- NF elements on sheet: FR18, FR25
- LMS7002M 1 power supply circuit
- (near FR18) NF
- (near FR25) NF
- Title
- Size:
- Date:
- A3
- Revision:
- Time:
- Sheet
- of
- File:
- (in symbol LMS7002M, part B) Part 2/5; aQFN-261

### Library data of the parts
C22 C24 C26 C28 C30 C32 C34 C36 C38 C40-C80 = Cap_0402: Manufacturer: TDK Corporation; Manufacturer Part Number 1: C0603X5R0J105M030BC; Capacitance: 1.0µF; Voltage - Rated: 6.3V; Temperature Coefficient: X5R; Value: 1uF, 20%; Supplier 1: Digi-Key; Supplier Part Number 1: 445-8008-1-ND; Applications: General Purpose; Features: -; Lead Style: -; Ratings: -; Thickness (Max): -; Lead Spacing: -; Height - Seated (Max): -; Size / Dimension: 0.024" L x 0.012" W (0.60mm x 0.30mm); Mounting Type: Surface Mount, MLCC; Operating Temperature: -55°C ~ 85°C; Package / Case: 0201 (0603 Metric); Tolerance: ±20%; Packaging: Cut Tape (CT); Category: Capacitors; RoHS: RoHS Compliant
C23 C25 C27 C29 C31 C33 C35 C37 C39 = Cap_0402: Manufacturer Part Number 1: C0603X7R1E102K030BA; Manufacturer: TDK Corporation; Voltage - Rated: 25V; Temperature Coefficient: X7R; Capacitance: 1000pF; Value: 1nF, 10%; Supplier 1: Digi-Key; Supplier Part Number 1: 445-7275-1-ND; Features: -; Package / Case: 0201 (0603 Metric); Lead Spacing: -; Mounting Type: Surface Mount, MLCC; Lead Style: -; Height - Seated (Max): -; Operating Temperature: -55°C ~ 125°C; Tolerance: ±10%; Size / Dimension: 0.024" L x 0.012" W (0.60mm x 0.30mm); Applications: General Purpose; Ratings: -; Thickness (Max): 0.013" (0.33mm); RoHS: RoHS Compliant; Packaging: Cut Tape (CT); Category: Capacitors
FR1-FR35 = Ferrite: Manufacturer Part Number 1: BK0603TS601-T; Manufacturer: Taiyo Yuden; DC Resistance (DCR): 750 mOhm Max; Filter Type: Differential Mode - Single; Impedance @ Frequency: 600 Ohm @ 100MHz; Current Rating: 270mA; Value: 600R@100MHz; Supplier 1: Digi-Key; Supplier Part Number 1: 587-3277-1-ND; Size / Dimension: 0.024" L x 0.012" W (0.60mm x 0.30mm); Package / Case: 0201 (0603 Metric); Height (Max): 0.013" (0.33mm); Mounting Type: Surface Mount; Packaging: Cut Tape (CT); RoHS: RoHS Compliant; Category: Filters
R16-R24 = Res_0402: Manufacturer Part Number 1: RC0402JR-070RL; Manufacturer: Yageo; Resistance (Ohms): 0.0; Tolerance: Jumper; Power (Watts): 0.063W, 1/16W; Value: 0R; Supplier 1: Digi-Key; Supplier Part Number 1: 311-0.0JRTR-ND; Category: Resistors; Temperature Coefficient: -; Features: Moisture Resistant; Supplier Device Package: 0402; Height: 0.016" (0.40mm); Package / Case: 0402 (1005 Metric); Operating Temperature: -55°C ~ 155°C; Size / Dimension: 0.039" L x 0.020" W (1.00mm x 0.50mm); Composition: Thick Film; Packaging: Tape & Reel (TR); Number of Terminations: 2; RoHS: RoHS Compliant
R25 R26 R28-R32 = Res_0402: Manufacturer Part Number 1: MCR006YRTJ000; Manufacturer: Rohm Semiconductor; Resistance (Ohms): 0.0; Power (Watts): 0.05W, 1/20W; Tolerance: Jumper; Value: 0R; Supplier 1: Digi-Key; Supplier Part Number 1: RHM0.0CCCT-ND; Number of Terminations: 2; Operating Temperature: -55°C ~ 125°C; Package / Case: 0201 (0603 Metric); Height: 0.010" (0.26mm); Supplier Device Package: 0201 (0603 Metric); Size / Dimension: 0.024" L x 0.012" W (0.60mm x 0.30mm); Temperature Coefficient: -; Category: Resistors; Features: -; RoHS: RoHS Compliant; Composition: Thick Film; Packaging: Cut Tape (CT)
R27 R33-R35 = Res_0402: Manufacturer: Panasonic Electronic Components; Manufacturer Part Number: ERJ-1GEF10R0C; Power (Watts): 0.05W, 1/20W; Resistance (Ohms): 10; Tolerance: ±1%; Temperature Coefficient: ±200ppm/°C; Value: 10R; Supplier 1: Digi-Key; Supplier Part Number 1: P10.0ABCT-ND; Package / Case: 0201 (0603 Metric); Height: 0.010" (0.26mm); Supplier Device Package: 0201; Packaging: Cut Tape (CT); Composition: Thick Film; Category: Resistors; Number of Terminations: 2; Size / Dimension: 0.024" L x 0.012" W (0.60mm x 0.30mm); Operating Temperature: -55°C ~ 125°C; Features: -; RoHS: RoHS Compliant
IC1 = LMS7002M: Manufacturer Part Number 1: LMS7002M; Supplier 1: Lime Microsystems

## Sheet 10_FPGA_power.SchDoc: FPGA power
size A3; Organization: Lime Microsystems; Address1: Surrey Tech Centre; Address2: Guildford GU2 7YG; Address3: Surrey; Address4: United Kingdom; Revision: SoDeRa-PCI v1.0; SheetNumber: 10; SheetTotal: 15
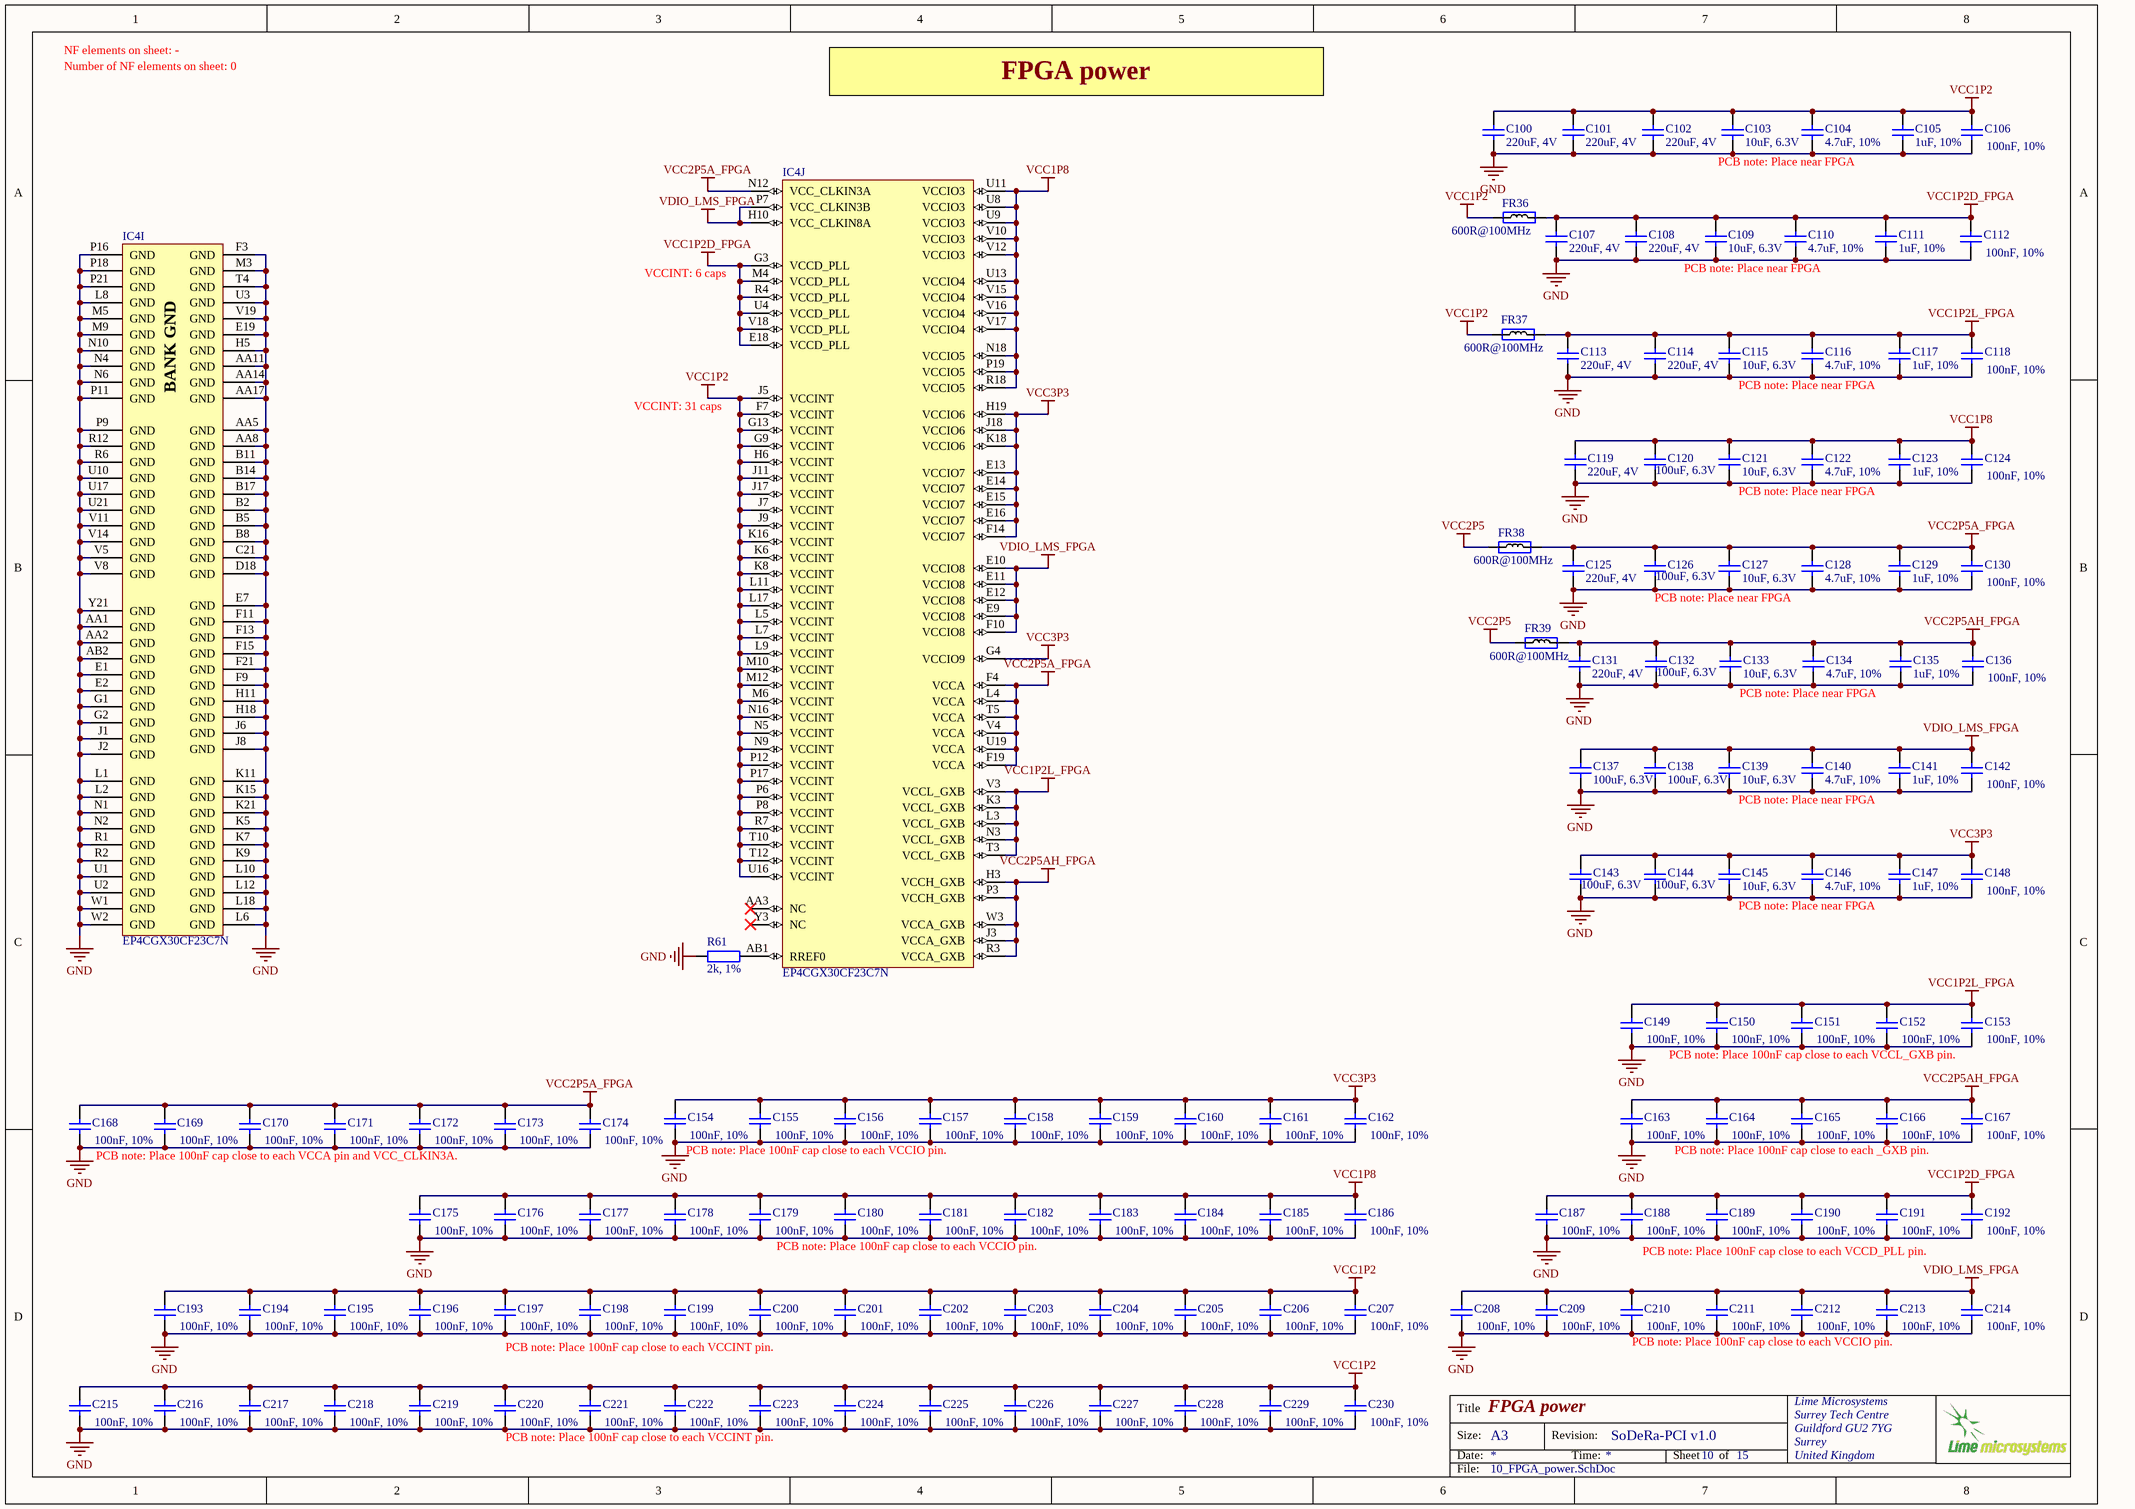
[diagram p5: 10_FPGA_power.SchDoc]

### Parts
C100  220uF, 4V  [CAP1206]
C101  220uF, 4V  [CAP1206]
C102  220uF, 4V  [CAP1206]
C103  10uF, 6.3V  [CAP0603]
C104  4.7uF, 10%  [CAP0603]
C105  1uF, 10%  [CAP0402]
C106  100nF, 10%  [CAP0402]
C107  220uF, 4V  [CAP1206]
C108  220uF, 4V  [CAP1206]
C109  10uF, 6.3V  [CAP0603]
C110  4.7uF, 10%  [CAP0603]
C111  1uF, 10%  [CAP0402]
C112  100nF, 10%  [CAP0402]
C113  220uF, 4V  [CAP1206]
C114  220uF, 4V  [CAP1206]
C115  10uF, 6.3V  [CAP0603]
C116  4.7uF, 10%  [CAP0603]
C117  1uF, 10%  [CAP0402]
C118  100nF, 10%  [CAP0402]
C119  220uF, 4V  [CAP1206]
C120  100uF, 6.3V  [CAP1206]
C121  10uF, 6.3V  [CAP0603]
C122  4.7uF, 10%  [CAP0603]
C123  1uF, 10%  [CAP0402]
C124  100nF, 10%  [CAP0402]
C125  220uF, 4V  [CAP1206]
C126  100uF, 6.3V  [CAP1206]
C127  10uF, 6.3V  [CAP0603]
C128  4.7uF, 10%  [CAP0603]
C129  1uF, 10%  [CAP0402]
C130  100nF, 10%  [CAP0402]
C131  220uF, 4V  [CAP1206]
C132  100uF, 6.3V  [CAP1206]
C133  10uF, 6.3V  [CAP0603]
C134  4.7uF, 10%  [CAP0603]
C135  1uF, 10%  [CAP0402]
C136  100nF, 10%  [CAP0402]
C137  100uF, 6.3V  [CAP1206]
C138  100uF, 6.3V  [CAP1206]
C139  10uF, 6.3V  [CAP0603]
C140  4.7uF, 10%  [CAP0603]
C141  1uF, 10%  [CAP0402]
C142  100nF, 10%  [CAP0402]
C143  100uF, 6.3V  [CAP1206]
C144  100uF, 6.3V  [CAP1206]
C145  10uF, 6.3V  [CAP0603]
C146  4.7uF, 10%  [CAP0603]
C147  1uF, 10%  [CAP0402]
C148  100nF, 10%  [CAP0402]
C149  100nF, 10%  [CAP0402]
C150  100nF, 10%  [CAP0402]
C151  100nF, 10%  [CAP0402]
C152  100nF, 10%  [CAP0402]
C153  100nF, 10%  [CAP0402]
C154  100nF, 10%  [CAP0402]
C155  100nF, 10%  [CAP0402]
C156  100nF, 10%  [CAP0402]
C157  100nF, 10%  [CAP0402]
C158  100nF, 10%  [CAP0402]
C159  100nF, 10%  [CAP0402]
C160  100nF, 10%  [CAP0402]
C161  100nF, 10%  [CAP0402]
C162  100nF, 10%  [CAP0402]
C163  100nF, 10%  [CAP0402]
C164  100nF, 10%  [CAP0402]
C165  100nF, 10%  [CAP0402]
C166  100nF, 10%  [CAP0402]
C167  100nF, 10%  [CAP0402]
C168  100nF, 10%  [CAP0402]
C169  100nF, 10%  [CAP0402]
C170  100nF, 10%  [CAP0402]
C171  100nF, 10%  [CAP0402]
C172  100nF, 10%  [CAP0402]
C173  100nF, 10%  [CAP0402]
C174  100nF, 10%  [CAP0402]
C175  100nF, 10%  [CAP0402]
C176  100nF, 10%  [CAP0402]
C177  100nF, 10%  [CAP0402]
C178  100nF, 10%  [CAP0402]
C179  100nF, 10%  [CAP0402]
C180  100nF, 10%  [CAP0402]
C181  100nF, 10%  [CAP0402]
C182  100nF, 10%  [CAP0402]
C183  100nF, 10%  [CAP0402]
C184  100nF, 10%  [CAP0402]
C185  100nF, 10%  [CAP0402]
C186  100nF, 10%  [CAP0402]
C187  100nF, 10%  [CAP0402]
C188  100nF, 10%  [CAP0402]
C189  100nF, 10%  [CAP0402]
C190  100nF, 10%  [CAP0402]
C191  100nF, 10%  [CAP0402]
C192  100nF, 10%  [CAP0402]
C193  100nF, 10%  [CAP0402]
C194  100nF, 10%  [CAP0402]
C195  100nF, 10%  [CAP0402]
C196  100nF, 10%  [CAP0402]
C197  100nF, 10%  [CAP0402]
C198  100nF, 10%  [CAP0402]
C199  100nF, 10%  [CAP0402]
C200  100nF, 10%  [CAP0402]
C201  100nF, 10%  [CAP0402]
C202  100nF, 10%  [CAP0402]
C203  100nF, 10%  [CAP0402]
C204  100nF, 10%  [CAP0402]
C205  100nF, 10%  [CAP0402]
C206  100nF, 10%  [CAP0402]
C207  100nF, 10%  [CAP0402]
C208  100nF, 10%  [CAP0402]
C209  100nF, 10%  [CAP0402]
C210  100nF, 10%  [CAP0402]
C211  100nF, 10%  [CAP0402]
C212  100nF, 10%  [CAP0402]
C213  100nF, 10%  [CAP0402]
C214  100nF, 10%  [CAP0402]
C215  100nF, 10%  [CAP0402]
C216  100nF, 10%  [CAP0402]
C217  100nF, 10%  [CAP0402]
C218  100nF, 10%  [CAP0402]
C219  100nF, 10%  [CAP0402]
C220  100nF, 10%  [CAP0402]
C221  100nF, 10%  [CAP0402]
C222  100nF, 10%  [CAP0402]
C223  100nF, 10%  [CAP0402]
C224  100nF, 10%  [CAP0402]
C225  100nF, 10%  [CAP0402]
C226  100nF, 10%  [CAP0402]
C227  100nF, 10%  [CAP0402]
C228  100nF, 10%  [CAP0402]
C229  100nF, 10%  [CAP0402]
C230  100nF, 10%  [CAP0402]
FR36  600R@100MHz  [RES0805]
FR37  600R@100MHz  [RES0805]
FR38  600R@100MHz  [RES0805]
FR39  600R@100MHz  [RES0805]
IC4  EP4CGX30CF23C7N  [ALTR-FBGA484_A-200]  (parts I,J of 10)
R61  2k, 1%  [RES0402]

### Nets
GND: C100.1 C101.1 C102.1 C103.1 C104.1 C105.2 C106.2 C107.1 C108.1 C109.1 C110.1 C111.2 C112.2 C113.1 C114.1 C115.1 C116.1 C117.1 C118.2 C119.1 C120.1 C121.1 C122.1 C123.1 C124.2 C125.1 C126.1 C127.1 C128.1 C129.1 C130.2 C131.1 C132.1 C133.1 C134.1 C135.1 C136.2 C137.1 C138.1 C139.1 C140.1 C141.1 C142.2 C143.1 C144.1 C145.1 C146.1 C147.1 C148.2 C149.2 C150.2 C151.2 C152.2 C153.2 C154.2 C155.2 C156.2 C157.2 C158.2 C159.2 C160.2 C161.2 C162.2 C163.2 C164.2 C165.2 C166.2 C167.2 C168.2 C169.2 C170.2 C171.2 C172.2 C173.2 C174.2 C175.2 C176.2 C177.2 C178.2 C179.2 C180.2 C181.2 C182.2 C183.2 C184.2 C185.2 C186.2 C187.2 C188.2 C189.2 C190.2 C191.2 C192.2 C193.2 C194.2 C195.2 C196.2 C197.2 C198.2 C199.2 C200.2 C201.2 C202.2 C203.2 C204.2 C205.2 C206.2 C207.2 C208.2 C209.2 C210.2 C211.2 C212.2 C213.2 C214.2 C215.2 C216.2 C217.2 C218.2 C219.2 C220.2 C221.2 C222.2 C223.2 C224.2 C225.2 C226.2 C227.2 C228.2 C229.2 C230.2 IC4.AA1(GND) IC4.AA2(GND) IC4.AA5(GND) IC4.AA8(GND) IC4.AA11(GND) IC4.AA14(GND) IC4.AA17(GND) IC4.AB2(GND) IC4.B2(GND) IC4.B5(GND) IC4.B8(GND) IC4.B11(GND) IC4.B14(GND) IC4.B17(GND) IC4.C21(GND) IC4.D18(GND) IC4.E1(GND) IC4.E2(GND) IC4.E7(GND) IC4.E19(GND) IC4.F3(GND) IC4.F9(GND) IC4.F11(GND) IC4.F13(GND) IC4.F15(GND) IC4.F21(GND) IC4.G1(GND) IC4.G2(GND) IC4.H5(GND) IC4.H11(GND) IC4.H18(GND) IC4.J1(GND) IC4.J2(GND) IC4.J6(GND) IC4.J8(GND) IC4.K5(GND) IC4.K7(GND) IC4.K9(GND) IC4.K11(GND) IC4.K15(GND) IC4.K21(GND) IC4.L1(GND) IC4.L2(GND) IC4.L6(GND) IC4.L8(GND) IC4.L10(GND) IC4.L12(GND) IC4.L18(GND) IC4.M3(GND) IC4.M5(GND) IC4.M9(GND) IC4.N1(GND) IC4.N2(GND) IC4.N4(GND) IC4.N6(GND) IC4.N10(GND) IC4.P9(GND) IC4.P11(GND) IC4.P16(GND) IC4.P18(GND) IC4.P21(GND) IC4.R1(GND) IC4.R2(GND) IC4.R6(GND) IC4.R12(GND) IC4.T4(GND) IC4.U1(GND) IC4.U2(GND) IC4.U3(GND) IC4.U10(GND) IC4.U17(GND) IC4.U21(GND) IC4.V5(GND) IC4.V8(GND) IC4.V11(GND) IC4.V14(GND) IC4.V19(GND) IC4.W1(GND) IC4.W2(GND) IC4.Y21(GND) R61.2
VCC1P2: C100.2 C101.2 C102.2 C103.2 C104.2 C105.1 C106.1 C193.1 C194.1 C195.1 C196.1 C197.1 C198.1 C199.1 C200.1 C201.1 C202.1 C203.1 C204.1 C205.1 C206.1 C207.1 C215.1 C216.1 C217.1 C218.1 C219.1 C220.1 C221.1 C222.1 C223.1 C224.1 C225.1 C226.1 C227.1 C228.1 C229.1 C230.1 FR36.1 FR37.1 IC4.F7(VCCINT) IC4.G9(VCCINT) IC4.G13(VCCINT) IC4.H6(VCCINT) IC4.J5(VCCINT) IC4.J7(VCCINT) IC4.J9(VCCINT) IC4.J11(VCCINT) IC4.J17(VCCINT) IC4.K6(VCCINT) IC4.K8(VCCINT) IC4.K16(VCCINT) IC4.L5(VCCINT) IC4.L7(VCCINT) IC4.L9(VCCINT) IC4.L11(VCCINT) IC4.L17(VCCINT) IC4.M6(VCCINT) IC4.M10(VCCINT) IC4.M12(VCCINT) IC4.N5(VCCINT) IC4.N9(VCCINT) IC4.N16(VCCINT) IC4.P6(VCCINT) IC4.P8(VCCINT) IC4.P12(VCCINT) IC4.P17(VCCINT) IC4.R7(VCCINT) IC4.T10(VCCINT) IC4.T12(VCCINT) IC4.U16(VCCINT)
VCC1P2D_FPGA: C107.2 C108.2 C109.2 C110.2 C111.1 C112.1 C187.1 C188.1 C189.1 C190.1 C191.1 C192.1 FR36.2 IC4.E18(VCCD_PLL) IC4.G3(VCCD_PLL) IC4.M4(VCCD_PLL) IC4.R4(VCCD_PLL) IC4.U4(VCCD_PLL) IC4.V18(VCCD_PLL)
VCC1P2L_FPGA: C113.2 C114.2 C115.2 C116.2 C117.2 C118.1 C149.1 C150.1 C151.1 C152.1 C153.1 FR37.2 IC4.K3(VCCL_GXB) IC4.L3(VCCL_GXB) IC4.N3(VCCL_GXB) IC4.T3(VCCL_GXB) IC4.V3(VCCL_GXB)
VCC1P8: C119.2 C120.2 C121.2 C122.2 C123.2 C124.1 C175.1 C176.1 C177.1 C178.1 C179.1 C180.1 C181.1 C182.1 C183.1 C184.1 C185.1 C186.1 IC4.N18(VCCIO5) IC4.P19(VCCIO5) IC4.R18(VCCIO5) IC4.U8(VCCIO3) IC4.U9(VCCIO3) IC4.U11(VCCIO3) IC4.U13(VCCIO4) IC4.V10(VCCIO3) IC4.V12(VCCIO3) IC4.V15(VCCIO4) IC4.V16(VCCIO4) IC4.V17(VCCIO4)
VCC2P5: FR38.1 FR39.1
VCC2P5A_FPGA: C125.2 C126.2 C127.2 C128.2 C129.2 C130.1 C168.1 C169.1 C170.1 C171.1 C172.1 C173.1 C174.1 FR38.2 IC4.F4(VCCA) IC4.F19(VCCA) IC4.L4(VCCA) IC4.N12(VCC_CLKIN3A) IC4.T5(VCCA) IC4.U19(VCCA) IC4.V4(VCCA)
VCC2P5AH_FPGA: C131.2 C132.2 C133.2 C134.2 C135.2 C136.1 C163.1 C164.1 C165.1 C166.1 C167.1 FR39.2 IC4.H3(VCCH_GXB) IC4.J3(VCCA_GXB) IC4.P3(VCCH_GXB) IC4.R3(VCCA_GXB) IC4.W3(VCCA_GXB)
VCC3P3: C143.2 C144.2 C145.2 C146.2 C147.2 C148.1 C154.1 C155.1 C156.1 C157.1 C158.1 C159.1 C160.1 C161.1 C162.1 IC4.E13(VCCIO7) IC4.E14(VCCIO7) IC4.E15(VCCIO7) IC4.E16(VCCIO7) IC4.F14(VCCIO7) IC4.G4(VCCIO9) IC4.H19(VCCIO6) IC4.J18(VCCIO6) IC4.K18(VCCIO6)
VDIO_LMS_FPGA: C137.2 C138.2 C139.2 C140.2 C141.2 C142.1 C208.1 C209.1 C210.1 C211.1 C212.1 C213.1 C214.1 IC4.E9(VCCIO8) IC4.E10(VCCIO8) IC4.E11(VCCIO8) IC4.E12(VCCIO8) IC4.F10(VCCIO8) IC4.H10(VCC_CLKIN8A) IC4.P7(VCC_CLKIN3B)
NetIC4_AB1: IC4.AB1(RREF0) R61.1

Not connected (* = marked no-connect by the designer): IC4 AA3(NC)* Y3(NC)*

### Notes on the sheet
- NF elements on sheet: -
- Number of NF elements on sheet: 0
- FPGA power
- PCB note: Place near FPGA
- (near IC4) VCCINT: 6 caps
- VCCINT: 31 caps
- PCB note: Place 100nF cap close to each VCCL_GXB pin.
- PCB note: Place 100nF cap close to each VCCA pin and VCC_CLKIN3A.
- PCB note: Place 100nF cap close to each VCCIO pin.
- PCB note: Place 100nF cap close to each _GXB pin.
- PCB note: Place 100nF cap close to each VCCD_PLL pin.
- PCB note: Place 100nF cap close to each VCCINT pin.
- Title
- Size:
- Date:
- A3
- Revision:
- Time:
- Sheet
- of
- File:
- (in symbol EP4CGX30CF23C7N, part I) BANK GND

### Library data of the parts
C100-C102 C107 C108 C113 C114 C119 C125 C131 = Cap_1206: Manufacturer Part Number: GRM31CR60G227ME11L; Manufacturer: Murata Electronics North America; Capacitance: 220µF; Temperature Coefficient: X5R; Tolerance: ±20%; Package / Case: 1206 (3216 Metric); Supplier 1: Digi-Key; Packaging: Cut Tape (CT); Size / Dimension: 0.126" L x 0.063" W (3.20mm x 1.60mm); Operating Temperature: -55°C ~ 85°C; Voltage - Rated: 4V; Mounting Type: Surface Mount, MLCC; Ratings: -; Supplier Part Number 1: 490-9774-1-ND; Category: Capacitors; Lead Spacing: -; Lead Style: -; Applications: General Purpose; Features: -; Height - Seated (Max): -; Thickness (Max): 0.075" (1.90mm); RoHS: RoHS Compliant; Value: 220uF, 4V
C103 C109 C115 C121 C127 C133 C139 C145 = Cap_0603: Manufacturer Part Number 1: CC0603MRX5R5BB106; Capacitance: 10µF; Tolerance: ±20%; Supplier 1: Digi-Key; Supplier Part Number 1: 311-1448-2-ND; Package / Case: 0603 (1608 Metric); Category: Capacitors; Voltage - Rated: 6.3V; Value: 10uF, 6.3V
C104 C110 C116 C122 C128 C134 C140 C146 = Cap_0603: Manufacturer Part Number 1: CGB3B1X5R1A475K055AC; Voltage Rating DC: 10 V; Temperature Coefficient / Code: +/- 15 %; Supplier 1: Mouser; Supplier Part Number 1: 810-CGB3B1X5R1A475KC; Capacitance: 4.7 uF; Operating Temperature Range: - 55 C to + 85 C; Category: Multilayer Ceramic Capacitors MLCC - SMD/SMT; Case Code - in: 0603; Package / Case: 0603 (1608 metric); Tolerance: 10 %; value: 4.7uF, 10%
C105 C111 C117 C123 C129 C135 C141 C147 = Cap_0402: Manufacturer Part Number 1: GRM155R61A105KE15J; Manufacturer: TDK; Voltage Rating: 10; Product Range: TDK - C Series; Ceramic Capacitor Case: 0402 [1005 Metric]; Capacitance: 1; Dielectric Characteristic: X6; Value: 1uF, 10%; Supplier 1: Newark; Supplier Part Number 1: 490-6298-2-ND; Capacitance Tolerance: ± 10%; MSL: -; RoHS: YES
C106 C112 C118 C124 C130 C136 C142 C148-C230 = Cap_0603: Manufacturer: Murata; Manufacturer Part Number 1: GRM155R71C104KA88D; Brand: Murata Electronics; Type: General Purpose MLCC; Capacitance: 0.1 uF; Temperature Coefficient / Code: +/- 15 %; Voltage Rating DC: 16 V; Supplier 1: Mouser; Supplier Part Number 1: 81-GRM155R71C104KA88; Tolerance: 10 %; Case Code - in: 0402; Category: Multilayer Ceramic Capacitors MLCC - SMD/SMT; Value: 100nF, 10%; Manufacturer Part Number: GRM155R71C104KA88D
C120 C126 C132 C137 C138 C143 C144 = Cap_1206: Manufacturer: MURATA; Manufacturer Part Number 1: GRM31CR60J107ME39L.; Capacitance Tolerance: ± 20%; Ceramic Capacitor Case: 1206 [3216 Metric]; Voltage Rating: 6.3; value: 100uF, 6.3V; Supplier Part Number 1: 1735535; Supplier 1: Farnell
FR36-FR39 = Ferrite: Manufacturer Part Number 1: MPZ2012S601AT000; Manufacturer: TDK Corporation; Filter Type: Differential Mode - Single; Impedance @ Frequency: 600 Ohm @ 100MHz; DC Resistance (DCR): 100 mOhm Max; Current Rating: 2A; Supplier 1: Digi-Key; Supplier Part Number 1: 445-2206-2-ND; Mounting Type: Surface Mount; RoHS: RoHS Compliant; Height (Max): 0.041" (1.05mm); Packaging: Tape & Reel (TR); Category: Filters; Package / Case: 0805 (2012 Metric); Size / Dimension: 0.079" L x 0.049" W (2.00mm x 1.25mm)
IC4 = EP4CGX30CF23C7N: Manufacturer: Altera; Voltage - Supply: 1.16 V ~ 1.24 V; Number of I/O: 290; Total RAM Bits: 1105920; Number of Logic Elements/Cells: 29440; Number of LABs/CLBs: 1840; Supplier 1: Digi-Key; Package / Case: 484-BGA; Operating Temperature: 0°C ~ 85°C; Mounting Type: Surface Mount; Number of Gates: -; Supplier Device Package: 484-FBGA (23x23); Category: Integrated Circuits (ICs); RoHS: RoHS Compliant; Supplier Part Number 1: 544-2730-ND; Manufacturer Part Number 1: EP4CGX30CF23C7N
R61 = Res_0402: Manufacturer: Yageo; Manufacturer Part Number: RC0402FR-072KL; Power (Watts): 0.063W, 1/16W; Temperature Coefficient: ±100ppm/°C; Packaging: Cut Tape (CT); Size / Dimension: 0.039" L x 0.020" W (1.00mm x 0.50mm); Operating Temperature: -55°C ~ 155°C; Resistance (Ohms): 2k; Number of Terminations: 2; Supplier Device Package: 0402; Tolerance: ±1%; Features: Moisture Resistant; Category: Resistors; Height: 0.016" (0.40mm); Composition: Thick Film; Supplier 1: Digi-Key; Supplier Part Number 1: 311-2KLRCT-ND; Package / Case: 0402 (1005 Metric); RoHS: RoHS Compliant; Value: 2k, 1%

## Sheet 14_Clocks_2.SchDoc: Clocks 2
size A4; Organization: Lime Microsystems; Address1: Surrey Tech Centre; Address2: Guildford GU2 7YG; Address3: Surrey; Address4: United Kingdom; Revision: SoDeRa-PCI v1.0; SheetNumber: 14; SheetTotal: 15
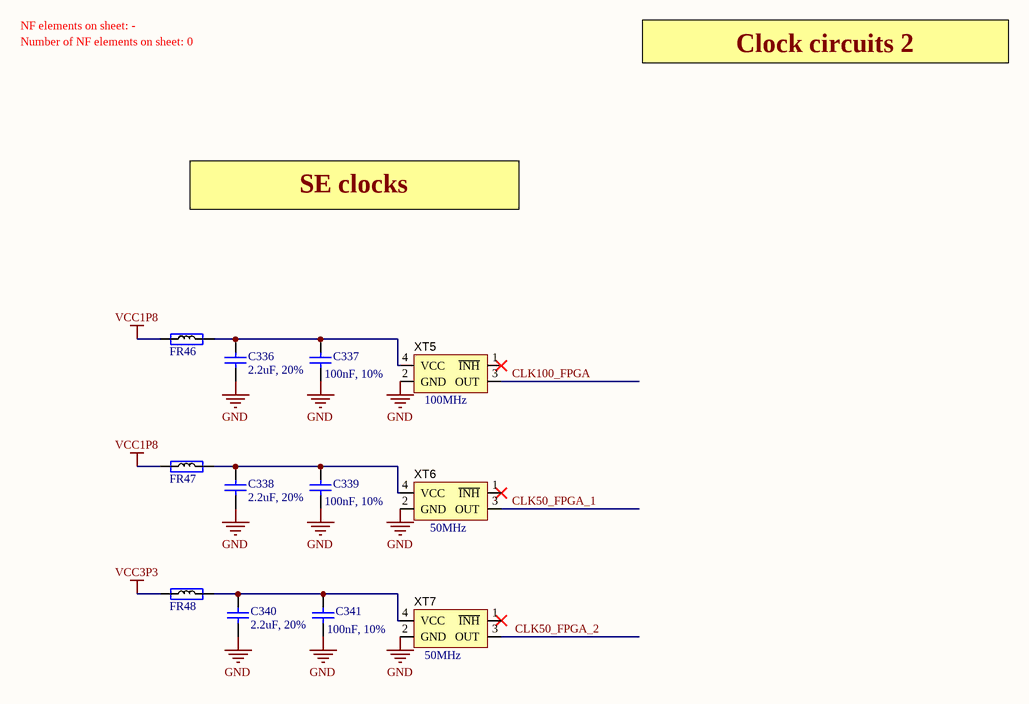
[diagram p6: 14_Clocks_2.SchDoc]

### Parts
C336  2.2uF, 20%  [CAP0402]
C337  100nF, 10%  [CAP0402]
C338  2.2uF, 20%  [CAP0402]
C339  100nF, 10%  [CAP0402]
C340  2.2uF, 20%  [CAP0402]
C341  100nF, 10%  [CAP0402]
FR46  Ferrite  [RES0201]  (value not drawn)
FR47  Ferrite  [RES0201]  (value not drawn)
FR48  Ferrite  [RES0201]  (value not drawn)
XT5  value 100MHz  [CRYSTAL_4-LCC_v4]  (hidden comment: CRYSTAL 100MHz)
XT6  value 50MHz  [CRYSTAL_4-LCC_v4]  (hidden comment: CRYSTAL 50MHz (nr. 1))
XT7  value 50MHz  [CRYSTAL_4-LCC_v4]  (hidden comment: CRYSTAL 50MHz (nr. 2))

### Nets
GND: C336.1 C337.2 C338.1 C339.2 C340.1 C341.2 XT5.2(GND) XT6.2(GND) XT7.2(GND)
VCC1P8: FR46.1 FR47.1
VCC3P3: FR48.1
CLK50_FPGA_1: XT6.3(OUT)
CLK50_FPGA_2: XT7.3(OUT)
CLK100_FPGA: XT5.3(OUT)
NetC336_2: C336.2 C337.1 FR46.2 XT5.4(VCC)
NetC338_2: C338.2 C339.1 FR47.2 XT6.4(VCC)
NetC340_2: C340.2 C341.1 FR48.2 XT7.4(VCC)

Not connected (* = marked no-connect by the designer): XT5 1(~{INH})*; XT6 1(~{INH})*; XT7 1(~{INH})*

### Notes on the sheet
- Number of NF elements on sheet: 0
- NF elements on sheet: -
- Clock circuits 2
- SE clocks
- Title
- Size:
- Date:
- A4
- Revision:
- Time:
- Sheet
- of
- File:

### Library data of the parts
C336 C338 C340 = Cap_0402: Manufacturer Part Number 1: C1005X5R1C225K050BC; Manufacturer: TDK Corporation; Voltage - Rated: 16V; Temperature Coefficient: X5R; Capacitance: 2.2µF; Value: 2.2uF, 20%; Supplier 1: Digi-Key; Supplier Part Number 1: 445-9085-1-ND; Category: Capacitors; Thickness (Max): 0.022" (0.55mm); Applications: General Purpose; Package / Case: 0402 (1005 Metric); Size / Dimension: 0.039" L x 0.020" W (1.00mm x 0.50mm); Features: -; Mounting Type: Surface Mount, MLCC; Ratings: -; Lead Style: -; Operating Temperature: -55°C ~ 85°C; Lead Spacing: -; RoHS: RoHS Compliant; Height - Seated (Max): -; Tolerance: ±20%; Packaging: Tape & Reel (TR)
C337 C339 C341 = Cap_0603: as C106 on sheet 10_FPGA_power; Supplier 1: Mouser; Supplier Part Number 1: 81-GRM155R71C104KA88; Tolerance: 10 %; Case Code - in: 0402; Category: Multilayer Ceramic Capacitors MLCC - SMD/SMT; Value: 100nF, 10%; Manufacturer Part Number: GRM155R71C104KA88D
FR46-FR48 = Ferrite: as FR1 on sheet 06_LMS7002M_Power; Supplier 1: Digi-Key; Supplier Part Number 1: 587-3277-1-ND; Size / Dimension: 0.024" L x 0.012" W (0.60mm x 0.30mm); Package / Case: 0201 (0603 Metric); Height (Max): 0.013" (0.33mm); Mounting Type: Surface Mount; Packaging: Cut Tape (CT); RoHS: RoHS Compliant; Category: Filters
XT5 = CRYSTAL: Oscillator Crystal; Manufacturer Part Number: KC5032A100.000C1GE00; Manufacturer: AVX Corp/Kyocera Corp; Current - Supply (Max): 19mA; Current - Supply (Disable) (Max): 10µA; Voltage - Supply: 1.8V, 2.5V, 3.3V; Function: Standby (Power Down); Output: CMOS; Frequency Stability: ±50ppm; Package / Case: 4-SMD, No Lead (DFN, LCC); Mounting Type: Surface Mount; Ratings: -; RoHS: RoHS Compliant; Height: 0.039" (1.00mm); Category: Crystals and Oscillators; Supplier Part Number 1: 1253-1302-1-ND; Supplier 1: Digi-Key; Size / Dimension: 0.197" L x 0.126" W (5.00mm x 3.20mm); Packaging: Cut Tape (CT); Frequency: 100MHz; Operating Temperature: -40°C ~ 85°C; Type: XO (Standard)
XT6 XT7 = CRYSTAL: Oscillator Crystal; Manufacturer Part Number: KC5032A50.0000CMGE00; Manufacturer: AVX Corp/Kyocera Corp; Current - Supply (Disable) (Max): 10µA; Frequency Stability: ±50ppm; Voltage - Supply: 1.8V, 2.5V, 3.3V, 5V; Output: CMOS; Current - Supply (Max): 9.5mA; Function: Standby (Power Down); Package / Case: 4-SMD, No Lead (DFN, LCC); Height: 0.039" (1.00mm); Supplier Part Number 1: 1253-1297-1-ND; Supplier 1: Digi-Key; Packaging: Cut Tape (CT); Category: Crystals and Oscillators; Mounting Type: Surface Mount; RoHS: RoHS Compliant; Frequency: 50MHz; Ratings: -; Type: XO (Standard); Size / Dimension: 0.197" L x 0.126" W (5.00mm x 3.20mm); Operating Temperature: -40°C ~ 85°C

## Nets that join several sheets
GND: 05_LMS7002M_RF (38 pins), 06_LMS7002M_Power (84 pins), 10_FPGA_power (212 pins), 14_Clocks_2 (9 pins)
VCC1P8: 10_FPGA_power (30 pins), 14_Clocks_2 (FR46.1 FR47.1)
VCC1P8_LMS: 05_LMS7002M_RF (16 pins), 06_LMS7002M_Power (11 pins)
VCC3P3: 10_FPGA_power (24 pins), 14_Clocks_2 (FR48.1)